# EAGLE design Power_28_10_15_v7 (EAGLE 6.2)
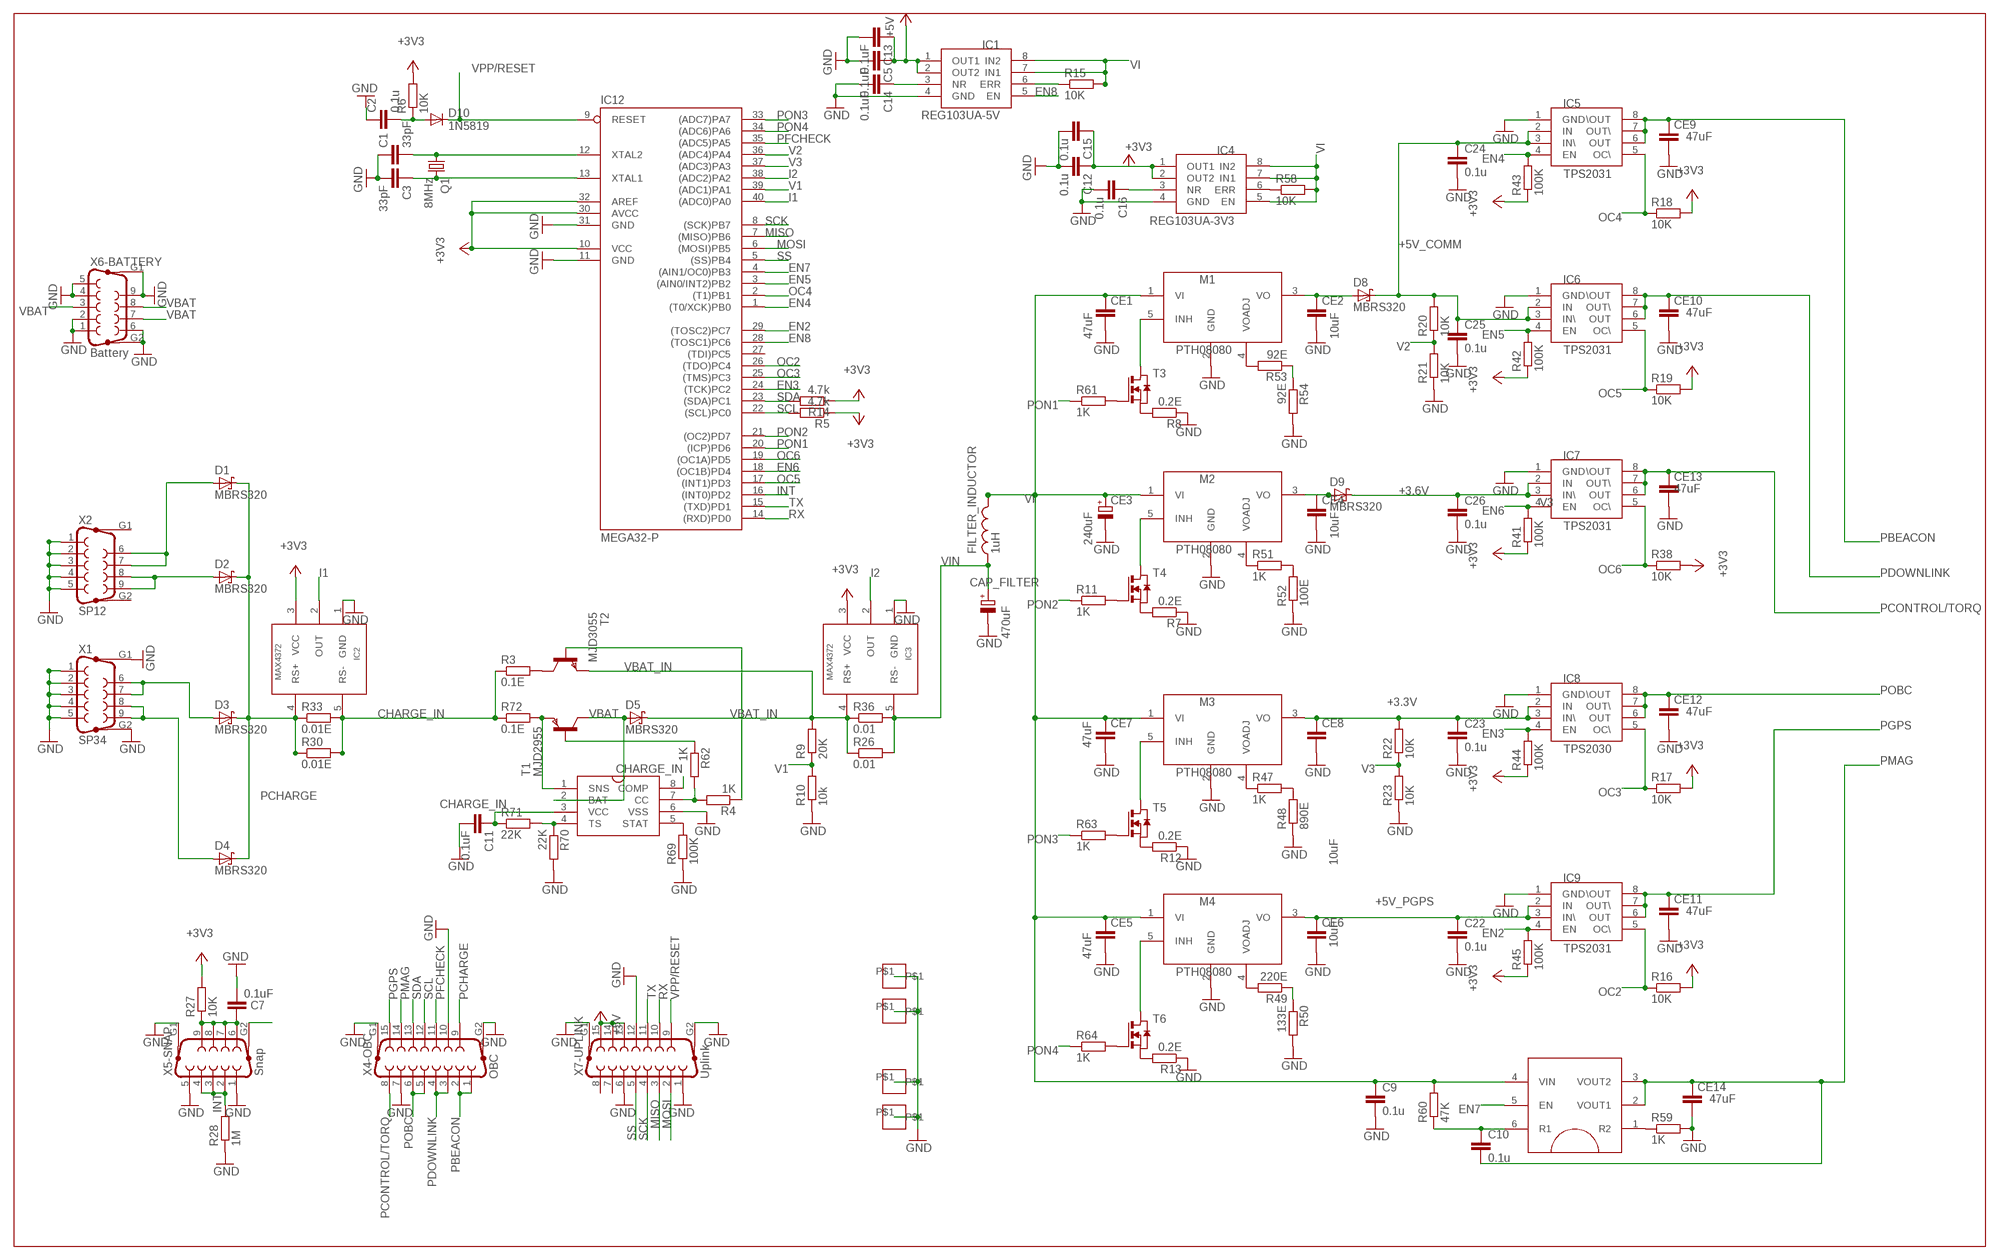
[diagram p0: schematic, sheet 1]

## Parts
C1  33pF  C-EUC1206  [C1206]
C2  0.1u  C-EUC1206  [C1206]
C3  33pF  C-EUC1206  [C1206]
C5  0.1uF  C-EUC1206  [C1206]
C7  0.1uF  C-EUC1206  [C1206]
C9  0.1u  C-EUC1206  [C1206]
C10  0.1u  C-EUC1206  [C1206]
C11  0.1uF  C-EUC1206  [C1206]
C12  0.1u  C-EUC1206  [C1206]
C13  0.1uF  C-EUC1206  [C1206]
C14  0.1uF  C-EUC1206  [C1206]
C15  0.1u  C-EUC1206  [C1206]
C16  0.1u  C-EUC1206  [C1206]
C22  0.1u  C-EUC1206  [C1206]
C23  0.1u  C-EUC1206  [C1206]
C24  0.1u  C-EUC1206  [C1206]
C25  0.1u  C-EUC1206  [C1206]
C26  0.1u  C-EUC1206  [C1206]
CAP_FILTER  470uF  CAP-POLT3  [CAP-POL-T3]
CE1  47uF  C-EUC1206K  [C1206K]
CE2  10uF  C-EUC1206K  [C1206K]
CE3  240uF  CAP-POLT2  [CAP-POL-T2]
CE4  10uF  C-EUC1206K  [C1206K]
CE5  47uF  C-EUC1206K  [C1206K]
CE6  10uF  C-EUC1206K  [C1206K]
CE7  47uF  C-EUC1206K  [C1206K]
CE8  10uF  C-EUC1206K  [C1206K]
CE9  47uF  C-EUC1206K  [C1206K]
CE10  47uF  C-EUC1206K  [C1206K]
CE11  47uF  C-EUC1206K  [C1206K]
CE12  47uF  C-EUC1206K  [C1206K]
CE13  47uF  C-EUC1206K  [C1206K]
CE14  47uF  C-EUC1206K  [C1206K]
D1  MBRS320  [DIODE]
D2  MBRS320  [DIODE]
D3  MBRS320  [DIODE]
D4  MBRS320  [DIODE]
D5  MBRS320  [DIODE]
D8  MBRS320  [DIODE]
D9  MBRS320  [DIODE]
D10  1N5819  DIODE-D-5  [D-5]
FILTER_INDUCTOR  1uH  MSS1260  [MSS1260]
IC1  REG103UA-5V  REG103UA-5  [SO8]
IC2  MAX4372  [SOT-23-5]
IC3  MAX4372  [SOT-23-5]
IC4  REG103UA-3V3  REG103UA-5  [SO8]
IC5  TPS2031  TPS203X  [SO-8]
IC6  TPS2031  TPS203X  [SO-8]
IC7  TPS2031  TPS203X  [SO-8]
IC8  TPS2030  TPS203X  [SO-8]
IC9  TPS2031  TPS203X  [SO-8]
IC10  FDC6324  [SUPER-SOT-6]
IC11  BO2057  [SOIC-8]
IC12  MEGA32-P  [DIL40]
M1  PTH08080  [DIP-05]
M2  PTH08080  [DIP-05]
M3  PTH08080  [DIP-05]
M4  PTH08080  [DIP-05]
Q1  8MHz  CRYSTALHC49S  [HC49/S]
R3  0.1E  R-EU_R1206  [R1206]
R4  1K  R-EU_R1206  [R1206]
R5  4.7k  R-EU_R1206  [R1206]
R6  10K  R-EU_R1206  [R1206]
R7  0.2E  R-EU_R1206  [R1206]
R8  0.2E  R-EU_R1206  [R1206]
R9  20K  R-EU_R1206  [R1206]
R10  10k  R-EU_R1206  [R1206]
R11  1K  R-EU_R1206  [R1206]
R12  0.2E  R-EU_R1206  [R1206]
R13  0.2E  R-EU_R1206  [R1206]
R14  4.7k  R-EU_R1206  [R1206]
R15  10K  R-EU_R1206  [R1206]
R16  10K  R-EU_R1206  [R1206]
R17  10K  R-EU_R1206  [R1206]
R18  10K  R-EU_R1206  [R1206]
R19  10K  R-EU_R1206  [R1206]
R20  10K  R-EU_R1206  [R1206]
R21  10K  R-EU_R1206  [R1206]
R22  10K  R-EU_R1206  [R1206]
R23  10K  R-EU_R1206  [R1206]
R26  0.01  R-EU_R1206  [R1206]
R27  10K  R-EU_R1206  [R1206]
R28  1M  R-EU_R1206  [R1206]
R30  0.01E  R-EU_R1206  [R1206]
R33  0.01E  R-EU_R1206  [R1206]
R36  0.01  R-EU_R1206  [R1206]
R38  10K  R-EU_R1206  [R1206]
R41  100K  R-EU_R1206  [R1206]
R42  100K  R-EU_R1206  [R1206]
R43  100K  R-EU_R1206  [R1206]
R44  100K  R-EU_R1206  [R1206]
R45  100K  R-EU_R1206  [R1206]
R47  1K  R-EU_R1206  [R1206]
R48  890E  R-EU_R1206  [R1206]
R49  220E  R-EU_R1206  [R1206]
R50  133E  R-EU_R1206  [R1206]
R51  1K  R-EU_R1206  [R1206]
R52  100E  R-EU_R1206  [R1206]
R53  92E  R-EU_R1206  [R1206]
R54  92E  R-EU_R1206  [R1206]
R58  10K  R-EU_R1206  [R1206]
R59  1K  R-EU_R1206  [R1206]
R60  47K  R-EU_R1206  [R1206]
R61  1K  R-EU_R1206  [R1206]
R62  1K  R-EU_R1206  [R1206]
R63  1K  R-EU_R1206  [R1206]
R64  1K  R-EU_R1206  [R1206]
R69  100K  R-EU_R1206  [R1206]
R70  22K  R-EU_R1206  [R1206]
R71  22K  R-EU_R1206  [R1206]
R72  0.1E  R-EU_R1206  [R1206]
T1  MJD2955  [DPAK-TO252]
T2  MJD3055  [DPAK-TO252]
T3  NMOSSOT23  [SOT-23]
T4  NMOSSOT23  [SOT-23]
T5  NMOSSOT23  [SOT-23]
T6  NMOSSOT23  [SOT-23]
U$4  MOUNT_SQ  [MOUNT_10MM]
U$16  MOUNT_SQ  [MOUNT_10MM]
U$18  MOUNT_SQ  [MOUNT_10MM]
U$19  MOUNT_SQ  [MOUNT_10MM]
X1  SP34  F09HP  [F09HP]
X2  SP12  F09HP  [F09HP]
X4-OBC  OBC  F15HP  [F15HP]
X5-SNAP  Snap  F09HP  [F09HP]
X6-BATTERY  Battery  F09HP  [F09HP]
X7-UPLINK  Uplink  F15HP  [F15HP]

## Nets
+3.3V [Power]: C23.1 CE8.1 IC8.2(IN) IC8.3(IN\) M3.3(VO) R22.2
+3.6V [Power]: C26.1 D9.C IC7.2(IN) IC7.3(IN\)
+3V3 [Power]: C12.1 C15.1 IC2.3(VCC) IC3.3(VCC) IC4.1(OUT1) IC4.2(OUT2) IC12.10(VCC) IC12.30(AVCC) IC12.32(AREF) R5.1 R6.2 R14.1 R16.2 R17.2 R18.2 R19.2 R27.2 R38.2 R41.1 R42.1 R43.1 R44.1 R45.1
+5V [Power]: C5.1 C13.1 IC1.1(OUT1) IC1.2(OUT2) X7-UPLINK.13 X7-UPLINK.14 X7-UPLINK.15
+5V_COMM [Power]: C24.1 C25.1 D8.C IC5.2(IN) IC5.3(IN\) IC6.2(IN) IC6.3(IN\) R20.2
+5V_PGPS [Power]: C22.1 CE6.1 IC9.2(IN) IC9.3(IN\) M4.3(VO)
CHARGE_IN [Power]: C11.1 IC2.5(RS-) IC11.3(VCC) IC11.8(COMP) R3.1 R30.2 R33.2 R71.1 R72.1
EN2: IC9.4(EN) IC12.29((TOSC2)PC7) R45.2
EN3: IC8.4(EN) IC12.24((TCK)PC2) R44.2
EN4: IC5.4(EN) IC12.1((T0/XCK)PB0) R43.2
EN5: IC6.4(EN) IC12.3((AIN0/INT2)PB2) R42.2
EN6: IC7.4(EN) IC12.18((OC1B)PD4) R41.2
EN7: IC10.5(EN) IC12.4((AIN1/OC0)PB3)
EN8: IC1.5(EN) IC12.28((TOSC1)PC6)
GND [Power]: C1.1 C2.1 C3.2 C5.2 C7.2 C9.2 C11.2 C12.2 C13.2 C14.2 C15.2 C16.2 C22.2 C23.2 C24.2 C25.2 C26.2 CAP_FILTER.P$2(-) CE1.2 CE2.2 CE3.P$2(-) CE4.2 CE5.2 CE6.2 CE7.2 CE8.2 CE9.2 CE10.2 CE11.2 CE12.2 CE13.2 CE14.2 IC1.4(GND) IC2.1(GND) IC3.1(GND) IC4.4(GND) IC5.1(GND) IC6.1(GND) IC7.1(GND) IC8.1(GND) IC9.1(GND) IC11.6(VSS) IC12.11(GND) IC12.31(GND) M1.2(GND) M2.2(GND) M3.2(GND) M4.2(GND) R7.1 R8.1 R10.1 R12.1 R13.1 R21.1 R23.1 R28.1 R48.1 R50.2 R52.1 R54.2 R59.2 R69.1 R70.2 U$4.P$1 U$16.P$1 U$18.P$1 U$19.P$1 X1.1 X1.2 X1.3 X1.4 X1.5 X1.G1 X1.G2 X2.1 X2.2 X2.3 X2.4 X2.5 X4-OBC.7 X4-OBC.10 X4-OBC.G1 X4-OBC.G2 X5-SNAP.1 X5-SNAP.5 X5-SNAP.G1 X5-SNAP.G2 X6-BATTERY.1 X6-BATTERY.2 X6-BATTERY.4 X6-BATTERY.5 X6-BATTERY.6 X6-BATTERY.9 X6-BATTERY.G1 X6-BATTERY.G2 X7-UPLINK.1 X7-UPLINK.6 X7-UPLINK.12 X7-UPLINK.G1 X7-UPLINK.G2
I1: IC2.2(OUT) IC12.40((ADC0)PA0)
I2: IC3.2(OUT) IC12.38((ADC2)PA2)
INT: IC12.16((INT0)PD2) R28.2 X5-SNAP.2 X5-SNAP.3 X5-SNAP.4
MISO: IC12.7((MISO)PB6) X7-UPLINK.3
MOSI: IC12.6((MOSI)PB5) X7-UPLINK.2
N$1: D3.A X1.6 X1.7
N$2: D2.A X2.8 X2.9
N$3: C7.1 R27.1 X5-SNAP.6 X5-SNAP.7 X5-SNAP.8 X5-SNAP.9
N$4: C16.1 IC4.3(NR)
N$5: C14.1 IC1.3(NR)
N$6: C2.2 D10.A R6.1
N$7: IC4.6(ERR) R58.1
N$8: R3.2 T2.2(C)
N$9 [Power]: CE2.1 D8.A M1.3(VO)
N$10 [Power]: CE4.1 D9.A M2.3(VO)
N$11: R4.1 T2.1(B)
N$12: C10.1 IC10.6(R1) R60.1
N$15: IC1.6(ERR) R15.1
N$16: M1.5(INH) T3.1(D)
N$18: M3.5(INH) T5.1(D)
N$19: M4.5(INH) T6.1(D)
N$20: R7.2 T4.2(S)
N$21: C3.1 IC12.13(XTAL1) Q1.2
N$22: R61.2 T3.3(G)
N$23: R8.2 T3.2(S)
N$24: R11.2 T4.3(G)
N$25: D4.A X1.8 X1.9
N$26: IC10.1(R2) R59.1
N$27: C1.2 IC12.12(XTAL2) Q1.1
N$28: R63.2 T5.3(G)
N$29: R12.2 T5.2(S)
N$30: R64.2 T6.3(G)
N$31: R13.2 T6.2(S)
N$32: M2.5(INH) T4.1(D)
N$34: D1.A X2.6 X2.7
N$45: M3.4(VOADJ) R47.1
N$46: R47.2 R48.2
N$47: M4.4(VOADJ) R49.2
N$48: R49.1 R50.1
N$49: M2.4(VOADJ) R51.1
N$50: R51.2 R52.2
N$51: M1.4(VOADJ) R53.2
N$52: R53.1 R54.1
N$57: R62.1 T1.1(B)
N$58: IC11.5(STAT) R69.2
N$59: IC11.4(TS) R70.1 R71.2
N$60: IC11.1(SNS) R72.2 T1.3(E)
N$63: IC11.7(CC) R4.2 R62.2
OC2: IC9.5(OC\) IC12.26((TDO)PC4) R16.1
OC3: IC8.5(OC\) IC12.25((TMS)PC3) R17.1
OC4: IC5.5(OC\) IC12.2((T1)PB1) R18.1
OC5: IC6.5(OC\) IC12.17((INT1)PD3) R19.1
OC6: IC7.5(OC\) IC12.19((OC1A)PD5) R38.1
PBEACON [Power]: CE9.1 IC5.6(OUT) IC5.7(OUT\) IC5.8(\OUT) X4-OBC.1 X4-OBC.2
PCHARGE [Power]: D1.C D2.C D3.C D4.C IC2.4(RS+) R30.1 R33.1 X4-OBC.9
PCONTROL/TORQ [Power]: CE13.1 IC7.6(OUT) IC7.7(OUT\) IC7.8(\OUT) X4-OBC.8
PDOWNLINK [Power]: CE10.1 IC6.6(OUT) IC6.7(OUT\) IC6.8(\OUT) X4-OBC.3 X4-OBC.4
PFCHECK: IC12.35((ADC5)PA5) X4-OBC.11
PGPS [Power]: CE11.1 IC9.6(OUT) IC9.7(OUT\) IC9.8(\OUT) X4-OBC.15
PMAG [Power]: C10.2 CE14.1 IC10.2(VOUT1) IC10.3(VOUT2) X4-OBC.14
POBC [Power]: CE12.1 IC8.6(OUT) IC8.7(OUT\) IC8.8(\OUT) X4-OBC.5 X4-OBC.6
PON1: IC12.20((ICP)PD6) R61.1
PON2: IC12.21((OC2)PD7) R11.1
PON3: IC12.33((ADC7)PA7) R63.1
PON4: IC12.34((ADC6)PA6) R64.1
RX: IC12.14((RXD)PD0) X7-UPLINK.10
SCK: IC12.8((SCK)PB7) X7-UPLINK.4
SCL: IC12.22((SCL)PC0) R5.2 X4-OBC.12
SDA: IC12.23((SDA)PC1) R14.2 X4-OBC.13
SS: IC12.5((SS)PB4) X7-UPLINK.5
TX: IC12.15((TXD)PD1) X7-UPLINK.11
V1: IC12.39((ADC1)PA1) R9.1 R10.2
V2: IC12.36((ADC4)PA4) R20.1 R21.2
V3: IC12.37((ADC3)PA3) R22.1 R23.2
VBAT [Power]: D5.A IC11.2(BAT) T1.2(C) X6-BATTERY.3 X6-BATTERY.7 X6-BATTERY.8
VBAT_IN: D5.C IC3.4(RS+) R9.2 R26.1 R36.1 T2.3(E)
VI [Power]: C9.1 CE1.1 CE3.P$1(+) CE5.1 CE7.1 FILTER_INDUCTOR.P$1 IC1.7(IN1) IC1.8(IN2) IC4.5(EN) IC4.7(IN1) IC4.8(IN2) IC10.4(VIN) M1.1(VI) M2.1(VI) M3.1(VI) M4.1(VI) R15.2 R58.2 R60.2
VIN [Power]: CAP_FILTER.P$1(+) FILTER_INDUCTOR.P$2 IC3.5(RS-) R26.2 R36.2
VPP/RESET: D10.C IC12.9(RESET) X7-UPLINK.9
Unconnected: IC12.27((TDI)PC5) X2.G1 X2.G2 X7-UPLINK.7 X7-UPLINK.8

## Library data of the parts
C1-C3 C5 C7 C9-C16 C22-C26 CE1 CE2 CE4-CE14 = rcl:C-EU: CAPACITOR, European symbol
CAP_FILTER CE3 = satellite:CAP-POL
D1-D5 D8 D9 = satellite:MBRS320
D10 = diode:DIODE-: DIODE
FILTER_INDUCTOR = inductor-coilcraft(2):MSS1260: SMT Power Inductor
IC1 IC4 = satellite:REG103UA-5
IC2 IC3 = satellite:MAX4372
IC5-IC9 = satellite:TPS203X
IC10 = satellite:FDC6324
IC11 = satellite:BO2057
IC12 = atmel:MEGA32-P: MICROCONTROLLER 32 Kbytes FLASH 2 Kbytes SRAM 1 Kbytes EEPROM USART 8-channel 10 bit ADC Source: www.atmel.com .. doc2503.pdf; MPN: ATMEGA32-16PU; OC_FARNELL: 1661729; OC_NEWARK: 51P1794
M1-M4 = satellite:PTH08080
Q1 = crystal:CRYSTAL: CRYSTAL
R3-R23 R26-R28 R30 R33 R36 R38 R41-R45 R47-R54 R58-R64 R69-R72 = rcl:R-EU_: RESISTOR, European symbol
T1 = satellite:MJD2955
T2 = satellite:MJD3055
T3-T6 = zetex:NMOSSOT23: MOS FET
U$4 U$16 U$18 U$19 = satellite:MOUNT_SQ
X1 X2 = con-subd:F09HP: SUB-D; OC_FARNELL: unknown; OC_NEWARK: unknown
X4-OBC X7-UPLINK = satellite:F15HP: SUB-D
X5-SNAP X6-BATTERY = satellite:F09HP: SUB-D

## Net classes
0 Signal: clearance 0.305 mm
1 Power: clearance 0.305 mm to class 0, clearance 0.305 mm
2 Signal1: clearance 0.305 mm to class 0, clearance 0.305 mm to class 1, clearance 0.305 mm

## Board
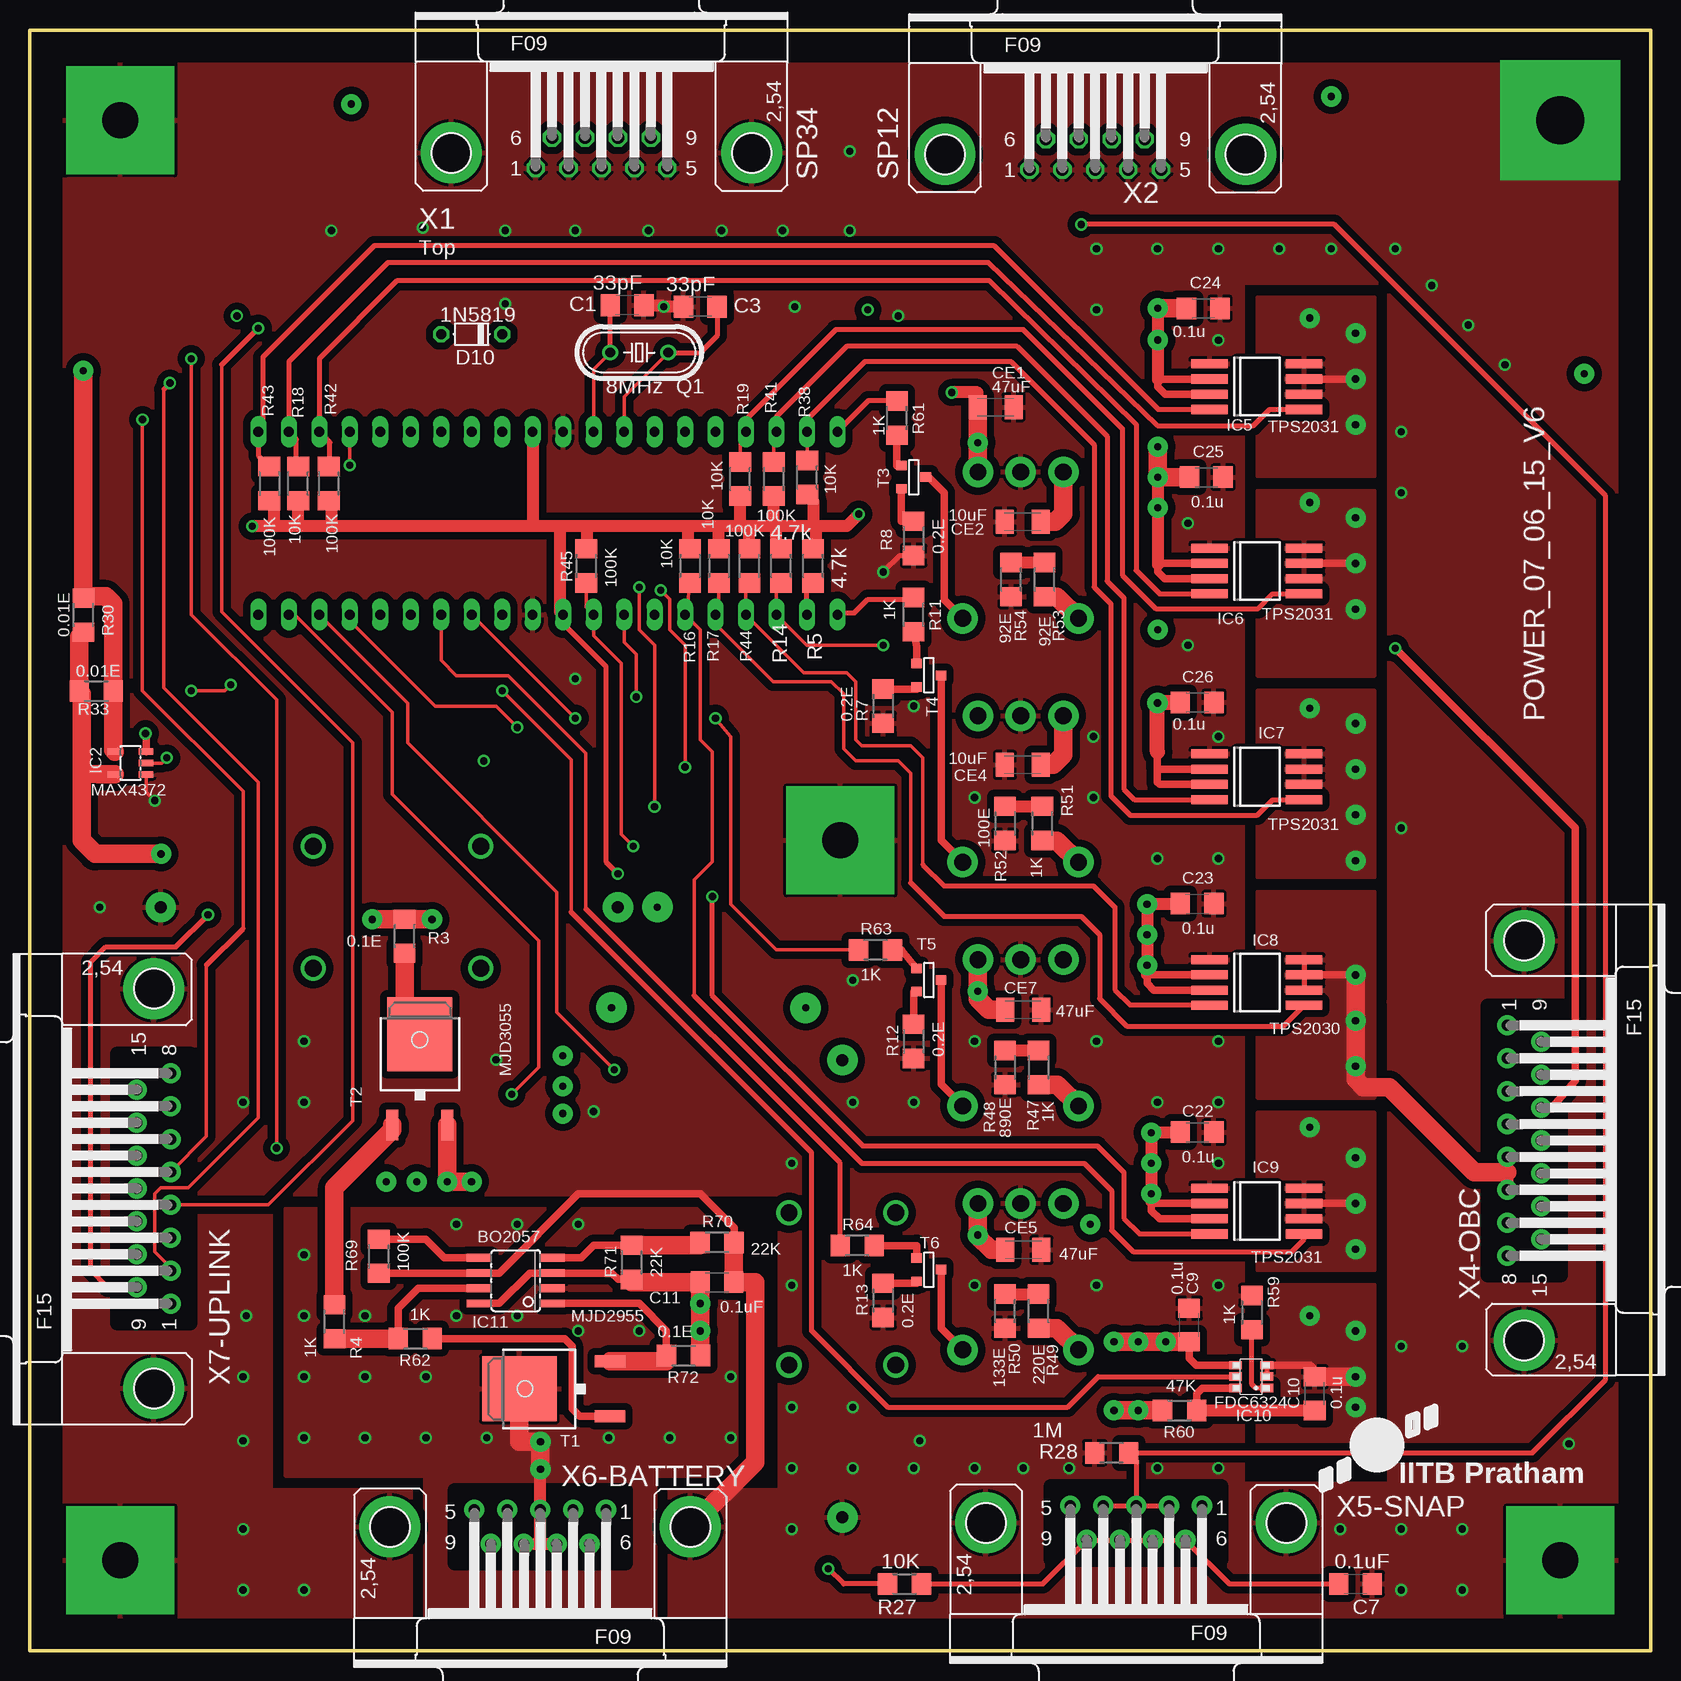
[diagram p1: board, top side]
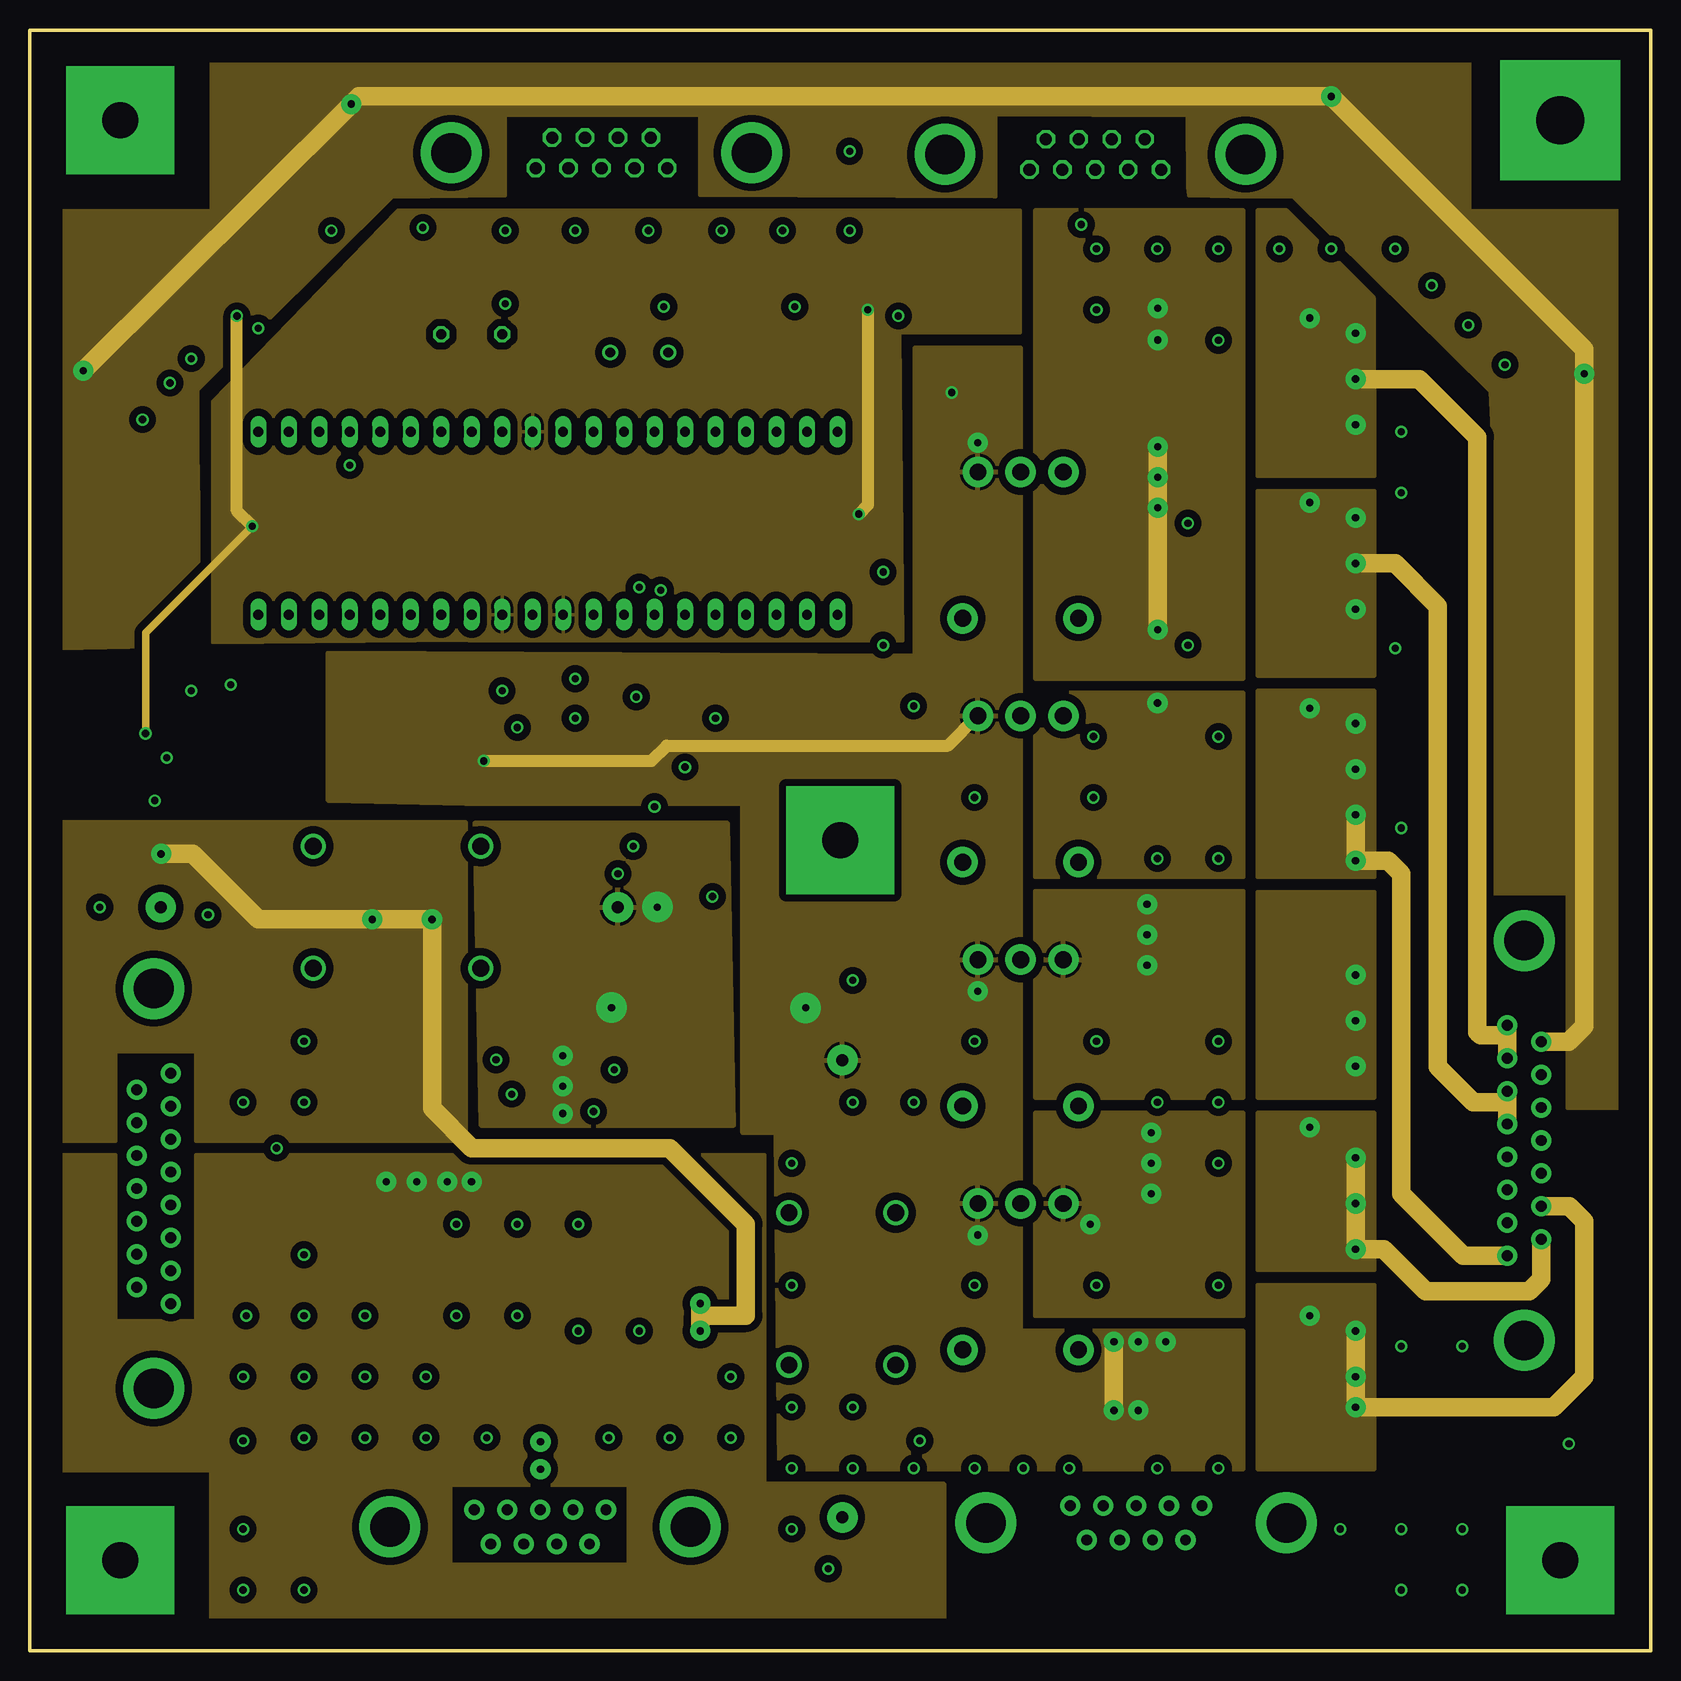
[diagram p2: board, inner layer Power]
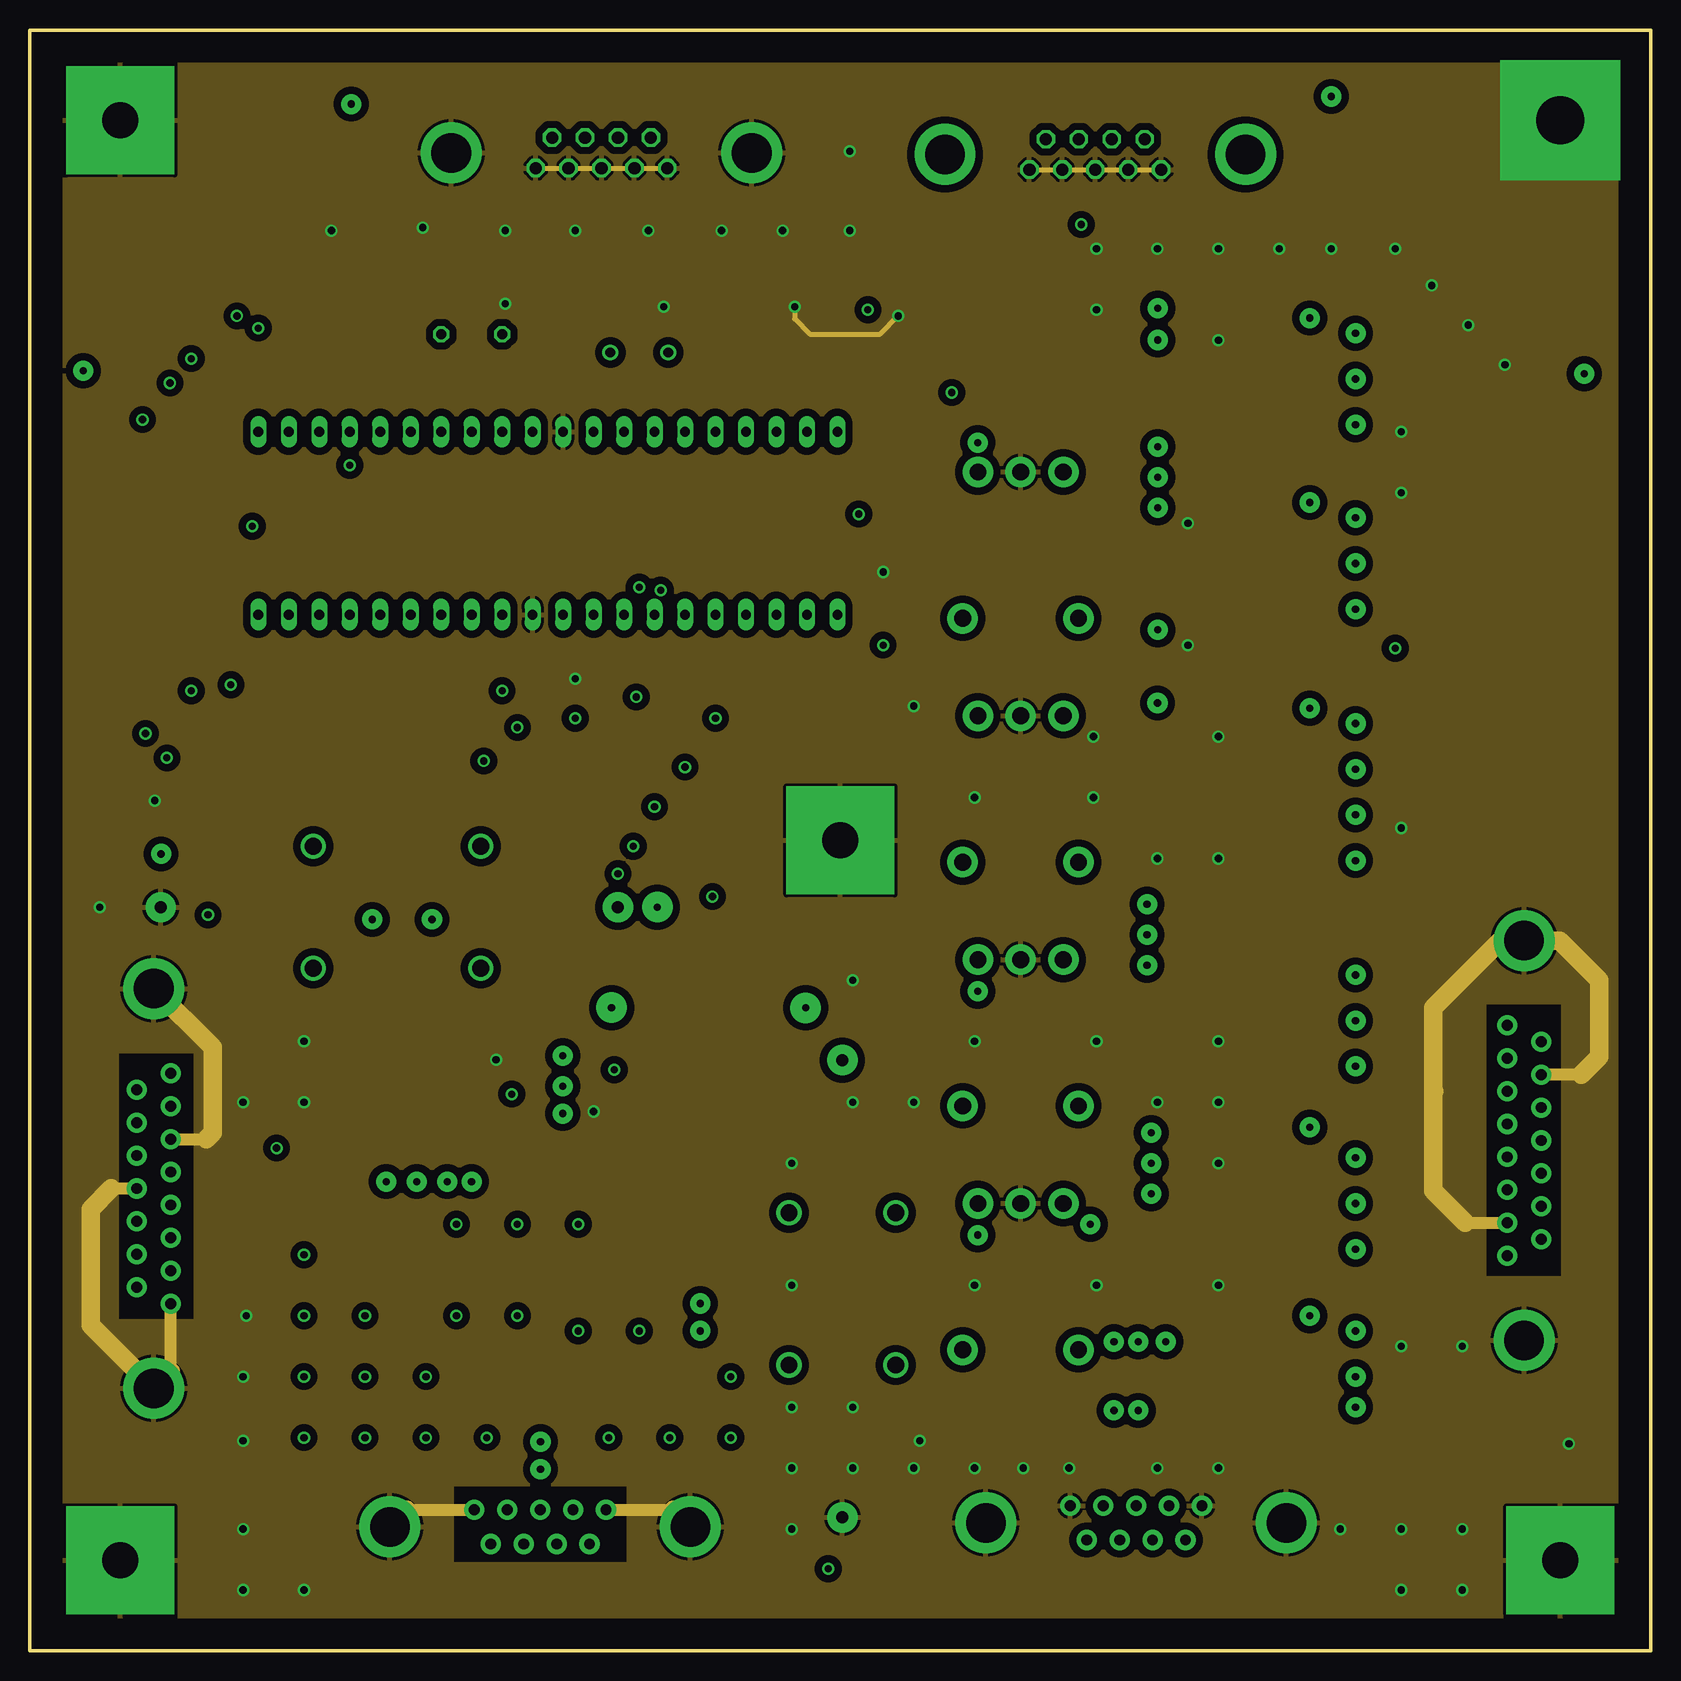
[diagram p3: board, inner layer GND]
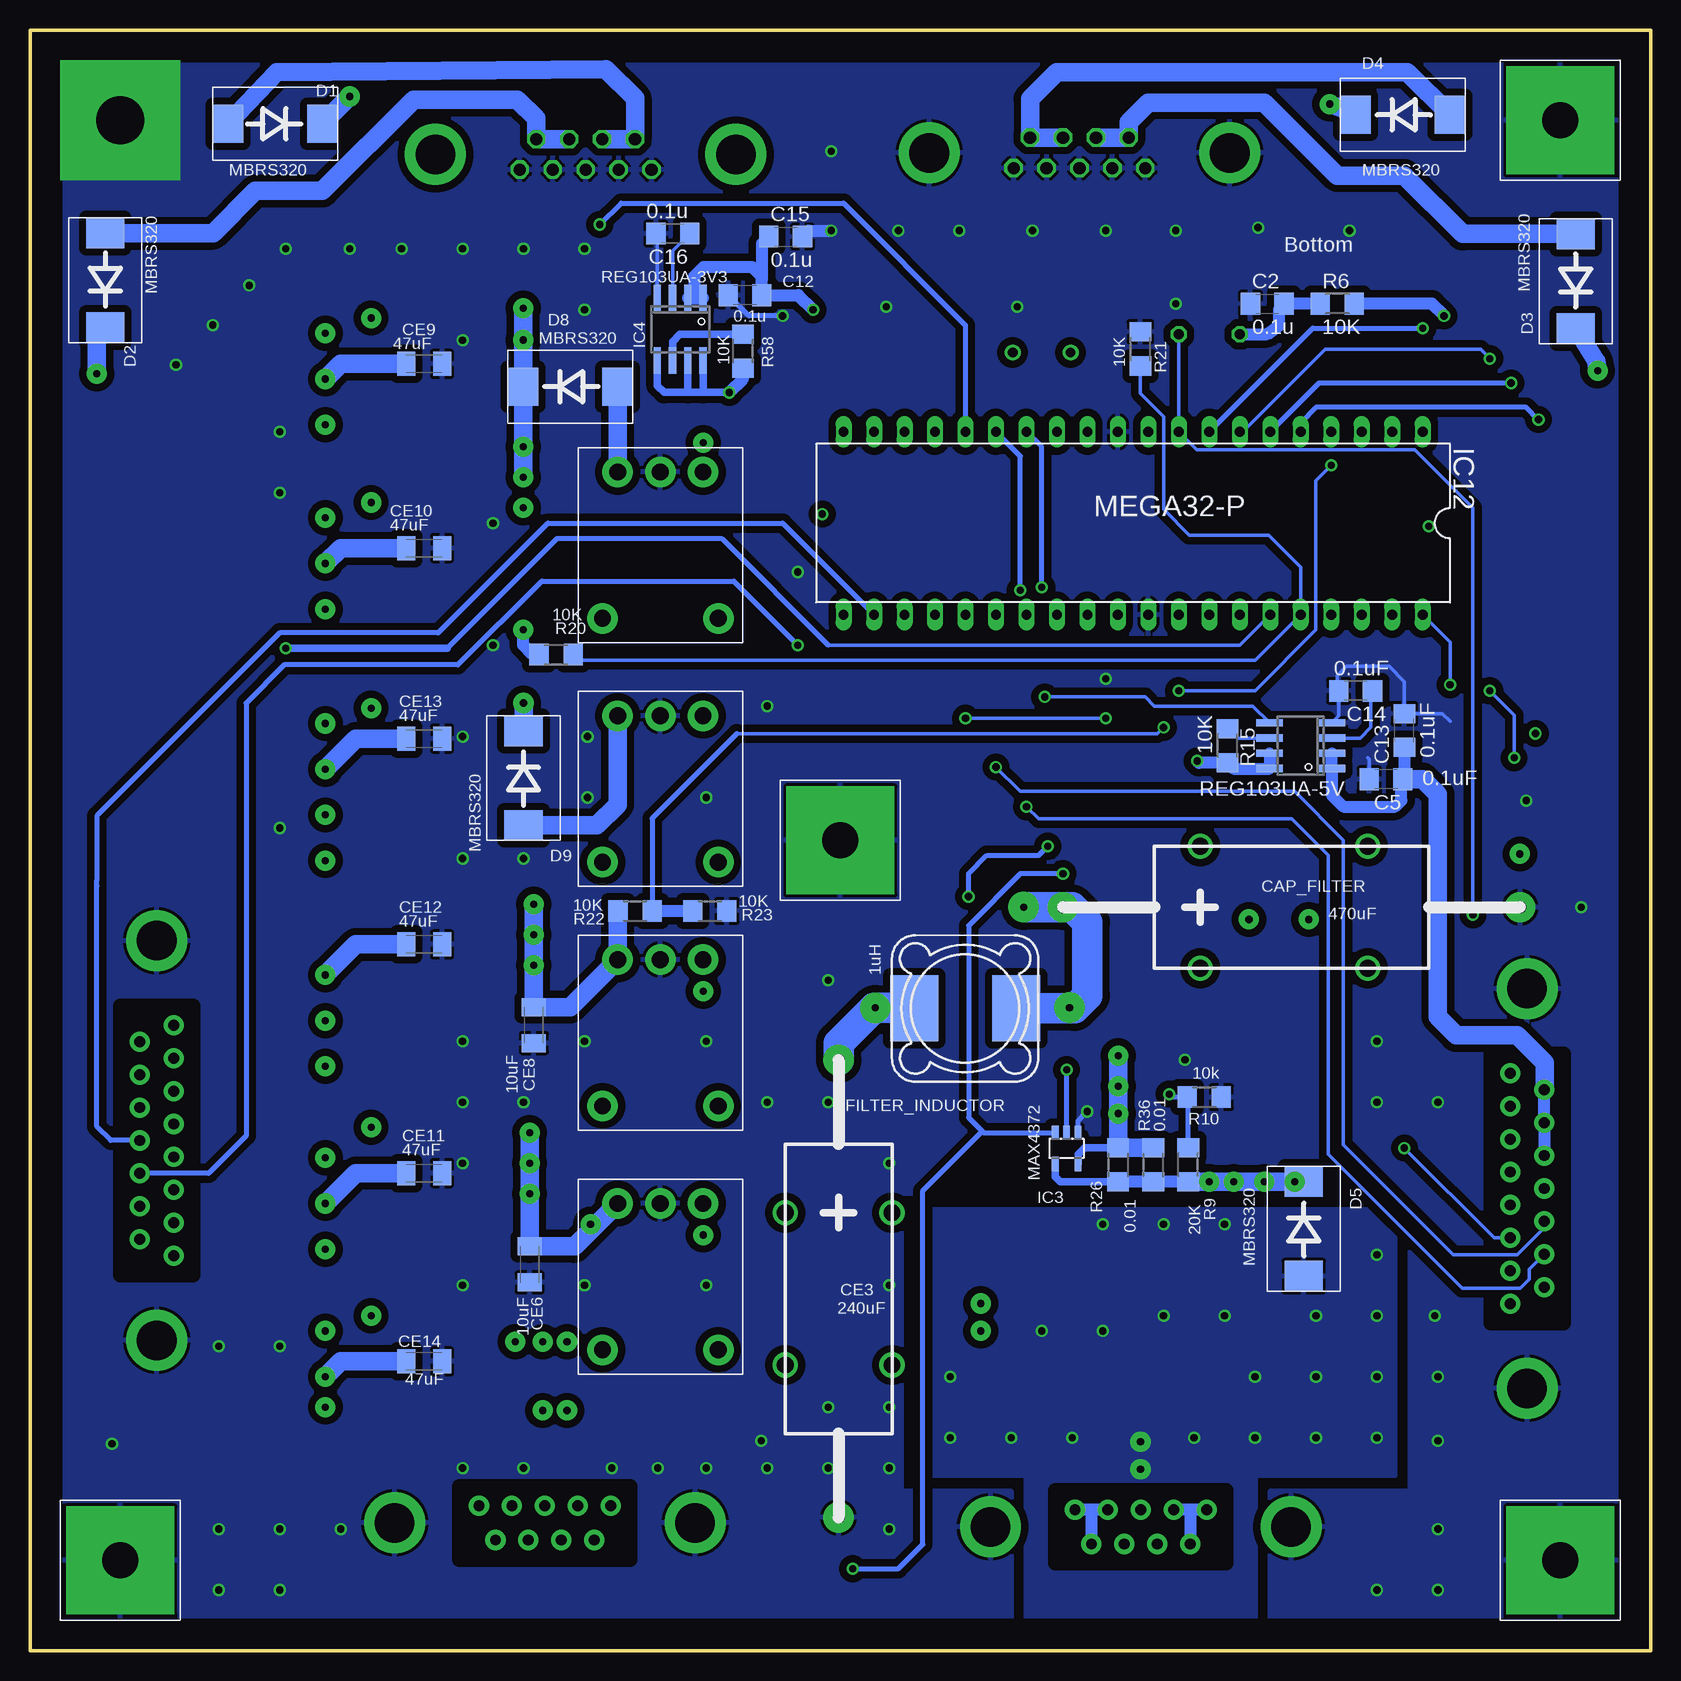
[diagram p4: board, bottom side, seen from below]

Size 135.08 x 135.08 mm. Coordinates in mm from the lower left corner, seen from the top.
Outline: 0,0 135.08,0 135.08,135.08 0,135.08 0,0
Copper layers (1*16): Top 0.07mm / dielectric 1.5mm / Bottom 0.07mm
Design rules: minimum track width 10mil, minimum drill 20mil, track to track 6mil, track to pad 6mil, pad to pad 6mil, via to via 6mil, smd to smd 6mil, copper to edge 100mil, drill to drill 8mil, minimum pad ring 10mil, minimum via ring 8mil, stop-mask expansion 4mil, vias tented up to drill 0mil, thermal gap 10mil

### Footprints (pad centres in the part's own frame; a part is rotated, then mirrored left to right if it is on the bottom)
C1206 = smd 1.6 x 1.8: 1 -1.4,0; 2 1.4,0
CAP-POL-T3 = drill 1 pad 2.54: P$1 -19.05,0; P$2 19.05,0 | drill 1.4 pad 1.397: P$3 -7.62,5.08; P$4 -7.62,-5.08; P$5 6.35,-5.08; P$6 6.35,5.08
C1206K = smd 1.5 x 2: 1 -1.5,0; 2 1.5,0
CAP-POL-T2 = drill 1 pad 2.54: P$1 -19.05,0; P$2 19.05,0 | drill 1.4 pad 1.397: P$3 6.35,4.445; P$4 -6.35,4.445; P$5 -6.35,-4.445; P$6 6.35,-4.445
DIODE = smd 2.54 x 3.175: A 7.366,0; C -0.508,0
D-5 = drill 0.813 octagon: A 2.54,0; C -2.54,0
MSS1260 = smd 5.5 x 4: P$1 0,4.25; P$2 0,-4.25
SO8 = smd 0.6 x 2.2: 1 -1.905,-2.6; 2 -0.635,-2.6; 3 0.635,-2.6; 4 1.905,-2.6; 5 1.905,2.6; 6 0.635,2.6; 7 -0.635,2.6; 8 -1.905,2.6
SOT-23-5 = smd 0.55 x 1.2: 1 -0.95,-1.3; 2 0,-1.3; 3 0.95,-1.3; 4 0.95,1.3; 5 -0.95,1.3
SO-8 = smd 0.762 x 3.048: 1 -1.905,-3.937; 2 -0.635,-3.937; 3 0.635,-3.937; 4 1.905,-3.937; 5 1.905,3.937; 6 0.635,3.937; 7 -0.635,3.937; 8 -1.905,3.937
SUPER-SOT-6 = smd 0.7 x 1.06: 1 -0.95,-1.3; 2 0,-1.3; 3 0.95,-1.3; 4 0.95,1.3; 5 0,1.3; 6 -0.95,1.3
SOIC-8 = smd 0.66 x 2.032: 1 -1.905,-3.073; 2 -0.635,-3.073; 3 0.635,-3.073; 4 1.905,-3.073; 5 1.905,3.073; 6 0.635,3.073; 7 -0.635,3.073; 8 -1.905,3.073
DIL40 = drill 0.813 long: 1 -24.13,-7.62; 2 -21.59,-7.62; 3 -19.05,-7.62; 4 -16.51,-7.62; 5 -13.97,-7.62; 6 -11.43,-7.62; 7 -8.89,-7.62; 8 -6.35,-7.62; 9 -3.81,-7.62; 10 -1.27,-7.62; 11 1.27,-7.62; 12 3.81,-7.62; 13 6.35,-7.62; 14 8.89,-7.62; 15 11.43,-7.62; 16 13.97,-7.62; 17 16.51,-7.62; 18 19.05,-7.62; 19 21.59,-7.62; 20 24.13,-7.62; 21 24.13,7.62; 22 21.59,7.62; 23 19.05,7.62; 24 16.51,7.62; 25 13.97,7.62; 26 11.43,7.62; 27 8.89,7.62; 28 6.35,7.62; 29 3.81,7.62; 30 1.27,7.62; 31 -1.27,7.62; 32 -3.81,7.62; 33 -6.35,7.62; 34 -8.89,7.62; 35 -11.43,7.62; 36 -13.97,7.62; 37 -16.51,7.62; 38 -19.05,7.62; 39 -21.59,7.62; 40 -24.13,7.62
DIP-05 = drill 1.4 pad 2.54: 1 -6.35,3.556; 2 -6.35,0; 3 -6.35,-3.556; 4 5.842,-4.826; 5 5.842,4.826
HC49/S = drill 0.813: 1 -2.413,0; 2 2.413,0
R1206 = smd 1.6 x 1.803: 1 -1.422,0; 2 1.422,0
DPAK-TO252 = smd 1 x 2.54: 1 -2.28,-5.054; 3 2.28,-5.054 | smd 5.4 x 6.2: 2 0,2.5
SOT-23 = smd 0.787 x 0.889: 1 0.025,-1.016; 2 -0.94,1.016; 3 0.991,1.016
MOUNT_10MM = drill 3 pad 9 square: P$1 0,0
F09HP = drill 1.016 octagon: 1 -5.486,-1.27; 2 -2.743,-1.27; 3 0,-1.27; 4 2.743,-1.27; 5 5.486,-1.27; 6 -4.115,1.27; 7 -1.372,1.27; 8 1.372,1.27; 9 4.115,1.27 | drill 3.302 pad 5.08: G1 -12.522,0; G2 12.522,0
F15HP = drill 0.9 pad 1.676: 1 -9.601,-1.422; 2 -6.858,-1.422; 3 -4.115,-1.422; 4 -1.372,-1.422; 5 1.372,-1.422; 6 4.115,-1.422; 7 6.858,-1.422; 8 9.601,-1.422; 9 -8.23,1.422; 10 -5.486,1.422; 11 -2.743,1.422; 12 0,1.422; 13 2.743,1.422; 14 5.486,1.422; 15 8.23,1.422 | drill 3.302 pad 5.08: G1 16.662,0; G2 -16.662,0
F09HP' = drill 0.9 pad 1.676: 1 -5.486,-1.422; 2 -2.743,-1.422; 3 0,-1.422; 4 2.743,-1.422; 5 5.486,-1.422; 6 -4.115,1.422; 7 -1.372,1.422; 8 1.372,1.422; 9 4.115,1.422 | drill 3.302 pad 5.08: G1 -12.522,0; G2 12.522,0

### Placement (x,y rotation side)
C1  49.76,112.14 180 top
C2  31.98,112.27 0 bottom
C3  55.85,112.01 180 top
C5  22.07,72.64 180 bottom
C7  110.46,5.59 0 top
C9  96.6,27.17 90 top
C10  107.06,21.45 90 top
C11  57.25,30.73 0 top
C12  75.49,112.98 180 bottom
C13  20.55,76.71 90 bottom
C14  24.61,80.01 180 bottom
C15  72.11,117.86 0 bottom
C16  81.51,118.11 180 bottom
C22  97.26,43.23 0 top
C23  97.26,62.28 0 top
C24  97.77,111.89 0 top
C25  98.02,97.82 0 top
C26  97.26,79.04 0 top
CAP_FILTER  29.95,61.98 0 bottom
CE1  80.48,103.66 0 top
CE2  82.73,94.1 180 top
CE3  67.69,30.18 270 bottom
CE4  82.73,73.84 180 top
CE5  82.78,33.43 0 top
CE6  93.45,32.21 270 bottom
CE7  82.75,53.42 0 top
CE8  93.09,52.15 270 bottom
CE9  102.23,107.27 0 bottom
CE10  102.23,91.9 0 bottom
CE11  102.23,39.83 0 bottom
CE12  102.23,58.88 0 bottom
CE13  102.23,76.03 0 bottom
CE14  102.23,24.13 0 bottom
D1  111.23,127.25 180 bottom
D2  128.8,110.79 90 bottom
D3  6.27,110.72 90 bottom
D4  24.1,128.02 0 bottom
D5  28.93,38.61 270 bottom
D8  93.47,105.36 0 bottom
D9  93.95,76.17 270 bottom
D10  36.8,109.73 180 top
FILTER_INDUCTOR  57.15,53.55 90 bottom
IC1  29.18,75.44 90 bottom
IC2  8.38,73.99 90 top
IC3  48.69,41.88 180 bottom
IC4  80.9,110.14 180 bottom
IC5  102.23,105.36 270 top
IC6  102.23,90 270 top
IC7  102.23,72.85 270 top
IC8  102.23,55.7 270 top
IC9  102.23,36.66 270 top
IC10  101.77,22.86 90 top
IC11  40.49,30.86 90 top
IC12  43.15,93.98 180 bottom
M1  82.55,91.9 270 bottom
M2  82.55,71.58 270 bottom
M3  82.55,51.26 270 bottom
M4  82.55,30.94 270 bottom
Q1  50.77,108.2 0 top
R3  31.22,59.56 270 top
R4  25.37,27.43 270 top
R5  65.25,90.42 270 top
R6  26.14,112.27 0 bottom
R7  71.09,78.74 90 top
R8  73.63,92.71 90 top
R9  38.56,40.51 270 bottom
R10  37.23,46.15 180 bottom
R11  73.63,86.36 270 top
R12  73.63,50.8 90 top
R13  71.09,29.21 90 top
R14  62.59,90.42 270 top
R15  35.28,75.44 270 bottom
R16  54.99,90.42 90 top
R17  57.4,90.42 90 top
R18  22.35,97.28 270 top
R19  59.18,97.66 270 top
R20  91.24,83.03 180 bottom
R21  42.55,108.51 270 bottom
R22  84.66,61.67 180 bottom
R23  78.44,61.67 180 bottom
R26  44.4,40.51 90 bottom
R27  72.87,5.59 180 top
R28  90.14,16.51 0 top
R30  4.45,86.31 270 top
R33  5.51,79.98 180 top
R36  41.48,40.51 90 bottom
R38  64.77,97.79 270 top
R41  61.98,97.66 90 top
R42  24.89,97.28 90 top
R43  19.94,97.28 90 top
R44  59.94,90.42 270 top
R45  46.36,90.42 270 top
R47  84.05,48.62 90 top
R48  81.25,48.62 90 top
R49  84.05,28.32 270 top
R50  81.25,28.32 270 top
R51  84.35,68.96 90 top
R52  81.25,68.96 90 top
R53  84.56,89.28 270 top
R54  81.76,89.28 270 top
R58  75.65,108.31 270 bottom
R59  101.83,28.19 90 top
R60  95.8,20.05 180 top
R61  72.24,102.74 270 top
R62  32.11,26.04 180 top
R63  70.46,58.42 0 top
R64  68.94,33.78 0 top
R69  29.06,32.89 90 top
R70  57.25,34.04 0 top
R71  50.14,32.38 90 top
R72  54.46,24.61 180 top
T1  43.28,21.84 90 top
T2  32.49,48.89 0 top
T3  73.63,97.79 90 top
T4  74.9,81.28 90 top
T5  74.9,55.88 90 top
T6  74.9,31.75 90 top
U$4  7.54,127.54 180 bottom
U$16  7.54,7.54 180 bottom
U$18  127.54,7.54 180 bottom
U$19  67.54,67.54 180 bottom
X1  47.62,124.84 0 top
X2  88.77,124.71 0 top
X4-OBC  124.51,42.54 270 top
X5-SNAP  Snap  [F09HP']  92.18,10.67 180 top
X6-BATTERY  Battery  [F09HP']  42.51,10.34 180 top
X7-UPLINK  10.31,38.54 90 top

### Tracks (layer width: path | path; a pad name or v marks a point on that pad's centre or on a via)
+3.3V  (via drill 0.6 pad 1.68)
  Top 0.61: 93.09,56.34 IC8.2 | 93.09,56.39 93.09,56.34 | IC8.3 93.65,55.07 93.09,55.63 93.09,56.34
  Top 1.016: C23.1 93.14,62.28 v93.09,62.23 93.09,56.39
  Bottom 1.524: v93.09,62.23 CE8.1 90.07,53.65 M3.3 86.11,61.67 R22.2
  other vias: 93.09,57.15 93.09,59.69
  pour Power (isolate 0.61): 83.79,63.32 101.07,63.32 101.07,46.1 83.79,46.1
+3.6V  (via drill 0.6 pad 1.68)
  Top 0.61: 93.95,73.48 93.95,74.93 | 93.95,73.48 IC7.2 | IC7.3 94.13,72.22 93.95,72.39 93.95,73.48
  Top 1.27: C26.1 93.95,79.05 v93.95,78.99 93.95,74.93
  Bottom 1.524: v93.95,78.99 D9.C
  pour Power (isolate 0.61): 83.79,79.83 101.07,79.83 101.07,64.52 83.79,64.52
+3V3  (via drill 0.6)
  Top 0.305: 9.68,76.4 v9.63,76.45
  Top 0.406: R27.2 67.79,5.59 v66.52,6.86 | IC12.30 44.42,85.6 47.98,82.04 47.98,65.79 v49,64.77
  Top 0.61: IC2.3 9.68,76.4
  Top 1.016: v69.06,94.74 68.05,93.73 65.51,93.73 | 65.51,93.73 65.25,93.73 | 65.25,93.73 62.2,93.73 | 62.2,93.73 61.95,93.73 | 61.95,93.73 59.92,93.73 | 59.92,93.73 59.16,93.73 | 59.16,93.73 57.38,93.73 | 57.38,93.73 54.84,93.73 | 54.84,93.73 46.46,93.73 | 46.46,93.73 44.17,93.73 | 44.17,93.73 41.88,93.73 | 41.88,93.73 25.12,93.73 | 25.12,93.73 22.33,93.73 | 22.33,93.73 20.29,93.73 | 20.29,93.73 v18.52,93.73 | R43.1 20.29,95.5 20.29,93.73 | R18.2 22.33,95.84 22.33,93.73 | R42.1 25.12,95.63 25.12,93.73 | R45.1 46.46,91.95 46.46,93.73 | IC12.10 41.88,93.73 | IC12.30 44.17,86.61 44.17,93.73 | R16.2 54.84,92 54.84,93.73 | R17.2 57.38,91.87 57.38,93.73 | R44.1 59.92,91.87 59.92,93.73 | R14.1 62.2,92.23 62.2,93.73 | R5.1 65.51,92.1 65.51,93.73 | R19.2 59.16,96.22 59.16,93.73 | R41.1 61.95,96.22 61.95,93.73 | R38.2 65.25,95.89 65.25,93.73
  Power 0.61: v9.63,76.45 9.63,84.84 v18.52,93.73
  Power 1.016: v69.82,111.76 69.82,95.5 v69.06,94.74 | v18.52,93.73 17.25,95 v17.25,111.25
  Bottom 0.406: v66.52,6.86 62.71,6.86 60.68,8.89 60.68,38.35 55.73,43.31 | v49,64.77 52.55,64.77 56.87,60.45 56.87,44.45 55.73,43.31 | 55.73,43.31 55.6,43.18 IC3.3
  Bottom 1.016: v69.82,111.76 71.04,112.98 C12.1 74.09,114.3 74.09,114.5 | v17.25,111.25 18.26,112.27 R6.2 | IC4.2 79.73,112.74 | 79.73,112.74 IC4.1 | 74.09,114.5 74.9,115.32 78.97,115.32 79.73,114.55 79.73,112.74 | C15.1 74.09,117.28 74.09,114.5
  pour Power (isolate 0.61): 30.63,120.05 15.21,104.14 15.21,84.01 36.42,84.21 36.55,84.2 72.75,84.2 72.49,109.86 82.52,109.86 82.52,120.05
+5V
  Bottom 1.016: X7-UPLINK.13 X7-UPLINK.14 X7-UPLINK.15 | IC1.2 IC1.1 26.58,71.31 25.63,70.36 21.31,70.36 20.8,70.87 20.8,72.51 C5.1 20.55,72.77 C13.1
  Bottom 1.524: C5.1 19.02,72.64 17.75,71.37 17.75,52.83 16.23,51.31 11.15,51.31 8.86,49.02 8.86,46.8 X7-UPLINK.15
+5V_COMM  (via drill 0.6 pad 1.68)
  Top 0.61: IC5.3 94.61,104.73 D8.C 93.98,105.97 98.27,105.97 IC5.2 | IC6.3 94.56,89.36 93.98,89.94 93.98,90.53 94.08,90.63 IC6.2
  Top 1.016: v93.98,111.89 93.98,105.97 | v93.98,97.82 93.98,90.53
  Top 1.524: C25.1 v93.98,97.82 v93.98,100.36 | v93.98,111.89 C24.1
  Power 1.524: v93.98,85.09 v93.98,100.36
  Bottom 1.016: R20.2 93.17,83.03 93.98,83.85 v93.98,85.09
  Bottom 1.524: v93.98,97.82 D8.C v93.98,111.89
  other vias: 93.98,109.25 93.98,95.28
  pour Power (isolate 0.61): 83.79,120.05 101.07,120.05 101.07,81.03 83.79,81.03
+5V_PGPS  (via drill 0.6 pad 1.68)
  Top 0.61: 93.45,37.46 93.45,37.34 | IC9.2 93.49,37.29 93.45,37.34 | IC9.3 94.13,36.02 93.45,36.7 93.45,37.34
  Top 1.016: C22.1 93.5,43.23 v93.45,43.18 93.45,37.46
  Bottom 1.524: v93.45,43.18 CE6.1 89.69,33.71 M4.3
  other vias: 93.45,38.1 88.37,35.56 93.45,40.64
  pour Power (isolate 0.61): 83.79,44.83 101.07,44.83 101.07,27.91 83.79,27.91
CHARGE_IN  (via drill 0.6 pad 1.68)
  Top 0.61: IC11.8 39.09,28.96 41.63,31.5 IC11.3 48.49,31.5 49.02,30.96 R71.1
  Top 1.524: v33.5,60.96 31.72,60.96 | v28.52,60.96 31.22,60.96 R3.1 | R72.1 55.86,24.61 v55.86,26.67 v55.85,26.67 v55.85,28.96 C11.1 50.14,30.73 R71.1 | v10.92,66.42 5.44,66.42 4.29,67.56 4.29,73.15 | IC2.5 5.67,73.04 4.29,73.15 | 4.29,84.74 R30.2 4.09,84.54 R33.2 4.29,79.79 4.29,73.15
  Power 1.524: v10.92,66.42 13.56,66.42 19.02,60.96 v28.52,60.96 32.99,60.96 | 55.85,27.94 59.66,27.94 59.66,35.56 53.31,41.91 36.8,41.91 33.5,45.21 v33.5,60.96 | v55.85,28.96 55.85,27.94 | v55.85,26.67 55.85,27.94
  pour Power (isolate 0.61): 2.51,42.55 7.12,42.55 7.12,50.04 13.85,50.04 13.85,42.55 36.3,42.55 36.3,69.02 2.51,69.02
EN2  (via drill 0.6)
  Top 0.305: R45.2 46.35,86.97 IC12.29 46.96,84.58 49.25,82.3 49.25,68.07 v50.27,67.06
  Top 0.406: 98.68,34.75 IC9.4 92.48,34.75 91.16,36.07 91.16,39.88 88.94,42.1 69.38,42.1 56.87,54.61 v56.87,62.87
  Bottom 0.406: v56.87,62.87 56.87,64.77 55.35,66.29 51.03,66.29 v50.27,67.06
EN3
  Top 0.305: 74.4,65.53 74.4,74.42 73.38,75.44 69.32,75.44 68.81,75.95 68.81,80.77 68.05,81.53 64.49,81.53 IC12.24 59.66,88.98
  Top 0.406: 74.4,65.53 76.17,63.75 88.62,63.75 90.4,61.98 90.4,55.12 91.67,53.85 98.25,53.85 IC8.4 | 59.66,88.98 R44.2
EN4
  Top 0.406: IC5.4 94,103.46 80.37,117.09 28.68,117.09 19.41,107.82 19.41,101.98 IC12.1 19.02,99.62 R43.2
EN5
  Top 0.406: IC6.4 94.13,88.09 92.18,90.04 92.18,102.23 79.98,114.17 30.58,114.17 24.1,107.7 IC12.3 24.99,100.71 24.99,99.06 24.89,98.96 R42.2
EN6
  Top 0.305: IC12.18 61.98,101.37 R41.2
  Top 0.406: IC7.4 92.03,70.95 91.16,71.82 91.16,87.76 89.76,89.15 89.76,101.22 82.27,108.71 68.05,108.71 62.2,102.87 IC12.18
EN7  (via drill 0.6)
  Top 0.305: 45.08,61.57 45.08,74.27 v39.34,80.01 | v26.64,98.81 IC12.4
  Top 0.406: IC10.5 89,22.86 86.46,20.32 71.48,20.32 65.13,26.67 65.13,41.53 45.08,61.57
  Bottom 0.305: v39.34,80.01 32.99,80.01 27.91,85.09 27.91,97.54 v26.64,98.81
EN8  (via drill 0.6)
  Top 0.305: IC12.28 49.5,84.07 50.52,83.06 v50.52,79.5
  Bottom 0.305: v50.52,79.5 42.14,79.5 41.38,78.74 33.18,78.74 IC1.5
GND  (via drill 0.6, 4 pad 10)
  Top 0.305: IC2.1 9.68,71.57 v10.39,70.87
  Top 0.406: R8.1 72.47,91.29 v71.09,89.92
  Top 0.61: IC7.1 98.33,74.76 98.37,74.8 | R70.2 58.67,35.28 55.85,38.1 45.69,38.1 39.09,31.5 IC11.6 29.06,31.5 R69.1
  Top 1.016: C1.1 52.68,112.14 v52.81,112.01 C3.2
  Top 1.524: X6-BATTERY.G1 60.43,15.73 60.43,30.73 C11.2 58.65,34.04 R70.2
  GND 0.406: v63.73,112.01 63.73,111 65,109.73 70.84,109.73 v72.36,111.25 | X2.1 X2.2 X2.3 X2.4 X2.5 | X1.1 X1.2 X1.3 X1.4 X1.5
  GND 1.016: 119.61,35.68 X4-OBC.7 | 129.28,48.03 X4-OBC.10 | 6.76,38.54 X7-UPLINK.12 | X7-UPLINK.6 14.69,42.66 | X6-BATTERY.1 53.61,11.76 | 31.41,11.76 X6-BATTERY.5 | 11.74,23.3 X7-UPLINK.1
  GND 1.524: 116.94,46.74 116.94,38.35 119.61,35.68 | 116.94,46.74 116.94,53.6 122.54,59.2 X4-OBC.G2 127.46,59.2 130.78,55.88 130.78,49.53 129.28,48.03 | 116.94,46.74 117.02,46.66 | 6.76,38.54 5.05,36.83 5.05,27.14 X7-UPLINK.G2 11.74,23.3 | 14.69,42.66 15.21,43.18 15.21,50.3 X7-UPLINK.G1 | 53.61,11.76 X6-BATTERY.G1 | X6-BATTERY.G2 31.41,11.76
  Bottom 0.305: IC1.4 26.01,77.92 C14.2 26.14,80.13 26.14,81.28 25.37,82.04 21.82,82.04 20.55,80.77 C13.2 17.38,78.11 16.74,77.47 | C5.2 23.47,74.3 23.6,74.42 | IC4.4 82.8,118 C16.2
  Bottom 0.406: IC3.1 47.74,44.18 v46.96,44.96 | 77.19,112.78 77.19,112.98 C12.2 75.16,111.25 v72.36,111.25
  Bottom 1.016: 38.4,11.76 X6-BATTERY.9 | X6-BATTERY.5 38.4,11.76 | 38.4,11.76 X6-BATTERY.4 | 46.63,11.76 X6-BATTERY.6 | X6-BATTERY.2 46.63,11.76 | 46.63,11.76 X6-BATTERY.1 | C15.2 70.2,118.36 v68.3,118.36
  other vias: 17.75,5.08 17.75,10.16 22.83,5.08 17.75,17.53 17.75,22.86 18.01,27.94 17.75,45.72 22.83,45.72 22.83,50.8 25.12,118.36 39.6,112.27 68.3,124.97 88.87,111.76 88.87,116.84 93.95,116.84 99.03,116.84 104.11,116.84 108.43,116.84 113.77,116.84 119.86,110.49 116.81,113.79 122.91,107.19 114.27,101.6 114.27,96.52 114.27,68.58 38.84,49.28 93.95,15.24 99.03,15.24 114.27,10.16 119.35,10.16 119.35,5.08 114.27,5.08 128.24,17.27 109.19,10.16 86.59,15.24 82.78,15.24 78.71,15.24 73.63,15.24 68.55,15.24 63.47,15.24 74.14,17.53 63.47,10.16 63.47,20.32 68.55,20.32 63.47,30.48 73.63,78.74 5.82,61.98 63.47,40.64 73.63,45.72 68.55,45.72 68.55,55.88 78.71,50.8 88.87,50.8 99.03,50.8 99.03,45.72 93.95,45.72 99.03,40.64 99.03,30.48 88.87,30.48 78.71,30.48 114.27,25.4 119.35,25.4 88.62,71.12 88.62,76.2 78.71,71.12 99.03,76.2 99.03,66.04 93.95,66.04 96.49,83.82 96.49,93.98 99.03,109.22 45.44,81.03 62.71,118.36 32.74,118.62 39.6,118.36 45.44,118.36 51.54,118.36 57.63,118.36 127.54,127.54
  pour Bottom (isolate 0.61): 2.51,132.54 2.51,2.54 31.72,2.54 31.72,13.34 20.07,13.34 20.07,38.1 62.46,38.1 62.46,13.34 53.31,13.34 53.31,2.54 132.51,2.54 132.51,132.54
  pour Top (isolate 0.61): 2.51,2.54 31.72,2.54 31.72,13.34 20.07,13.34 20.07,38.1 62.46,38.1 62.46,13.34 53.31,13.34 53.31,2.54 132.51,2.54 132.51,54.03 113.26,54.03 113.26,13.88 101.07,13.88 101.07,114.05 113.26,114.05 113.26,54.17 132.51,54.17 132.51,132.54 2.51,132.54
  pour GND (isolate 0.61): 2.44,132.24 39.61,132.36 39.94,132.37 40.36,132.37 41.02,132.38 42.04,132.4 42.29,132.41 80.05,132.54 80.05,132.62 81.23,132.54 84.71,132.64 95.81,132.61 96.01,132.59 98.48,132.66 102.35,132.61 106.21,132.59 132.51,132.67 132.51,99.95 132.59,99.95 132.59,86.8 132.53,86.17 132.53,85.34 132.51,84.58 132.51,54.04 121.16,54.04 121.16,31.05 127.83,31.05 127.83,53.91 132.51,53.91 132.51,2.54 99.99,2.54 96.48,2.55 84.23,2.55 83.24,2.56 79.74,2.56 80.05,2.54 49.95,2.54 49.95,13.88 35.09,13.88 35.09,7.21 49.76,7.21 49.76,2.54 2.51,2.54 2.51,27.5 13.85,27.5 13.85,49.97 7.18,49.97 7.18,27.62 2.51,27.62 2.51,85.15 2.42,88.96 2.42,90.81 2.48,92.84 2.48,94.04 2.51,95.44
I1  (via drill 0.6)
  Top 0.305: IC2.2 10.98,73.99 v11.4,74.42 | v13.44,80.01 16.23,80.01 v16.74,80.52
  Bottom 0.305: v11.4,74.42 11.4,77.98 v13.44,80.01 | v16.74,80.52 16.74,84.07 IC12.40
I2  (via drill 0.6)
  Top 0.305: IC12.38 31.47,78.99 31.47,75.69 43.92,63.25 43.92,53.21 v48.69,48.44
  Bottom 0.406: IC3.2 v48.69,48.44
INT  (via drill 0.6)
  Top 0.406: X5-SNAP.4 X5-SNAP.3 | X5-SNAP.3 X5-SNAP.2 | X5-SNAP.3 92.18,15.9 R28.2 125.2,16.51 131.29,22.61 131.29,96.27 108.69,118.87 v87.6,118.87
  Bottom 0.406: v87.6,118.87 85.83,120.65 67.28,120.65 57.12,110.49 IC12.16
MISO  (via drill 0.6)
  Top 0.305: v20.55,41.91 20.55,79.25 13.44,86.36 v13.44,107.7
  Bottom 0.305: X7-UPLINK.3 13.06,34.43 v20.55,41.91 | v13.44,107.7 14.2,108.46 27.15,108.46 34.01,101.6 IC12.7
MOSI  (via drill 0.6)
  Top 0.305: 11.15,105.16 11.15,80.26 19.02,72.39 19.02,44.45 13.18,38.61 10.9,38.61 10.39,38.1 10.39,33.27 11.74,31.93
  Top 0.406: v11.66,105.66 11.15,105.16 | 11.74,31.93 X7-UPLINK.2
  Bottom 0.406: IC12.6 27.66,105.66 v11.66,105.66
N$1
  Bottom 1.524: D3.A 15.7,118.09 20.55,122.94 26.14,122.94 32.23,129.03 41.88,129.03 43.51,127.41 X1.6 X1.7
N$2
  Bottom 1.524: D2.A 119.81,118.16 116.31,121.67 110.72,121.67 103.1,129.29 94.46,129.29 92.89,127.71 X2.9 X2.8
N$3
  Top 0.406: R27.1 84.4,5.59 X5-SNAP.9 X5-SNAP.8 X5-SNAP.7 X5-SNAP.6 99.95,5.59 C7.1
N$4
  Bottom 0.305: IC4.3 81.53,116.69 C16.1
N$5
  Bottom 0.305: IC1.3 24.23,76.07 23.34,76.96 23.34,79.88 C14.1
N$6
  Bottom 1.016: R6.1 C2.2 30.96,111.88 30.96,110.49 31.98,109.73 D10.A
N$7
  Bottom 0.61: IC4.6 81.53,109.12 80.92,109.73 R58.1
N$8
  Top 1.016: T2.2 31.22,51.39
  Top 1.524: 31.22,51.39 R3.2
N$9
  Top 1.524: CE2.1 85.44,94.1 86.11,94.77 M1.3
  Bottom 1.524: M1.3 D8.A
N$10
  Top 1.524: CE4.1 85.27,73.84 86.11,74.68 M2.3
  Bottom 1.524: D9.A 87.83,68.81 86.11,70.54 M2.3
N$11
  Top 1.524: R4.1 25.37,38.61 30.21,43.44 T2.1
N$12
  Top 0.61: IC10.6 97.7,21.91 97.22,21.43 R60.1
  Top 1.016: R60.1 C10.1
N$15
  Bottom 0.305: R15.1 34.49,76.07 IC1.6
N$16
  Top 0.61: T3.1 74.88,97.82 76.17,96.52 76.17,87.61 M1.5
N$18
  Top 0.61: T5.1 75.92,47.22 M3.5
N$19
  Top 0.61: T6.1 75.92,26.9 M4.5
N$20
  Top 0.61: T4.2 73.89,80.16 R7.2
N$21
  Top 0.305: Q1.2 49.5,104.52 IC12.13
  Top 0.406: C3.1 57.25,109.6 55.85,108.2 Q1.2
N$22
  Top 0.61: R61.2 72.24,98.78 T3.3
N$23
  Top 0.61: T3.2 72.62,94.13 R8.2
N$24
  Top 0.61: T4.3 73.89,83.67 R11.2
N$25
  Bottom 1.524: D4.A 20.29,131.57 49.5,131.57 51.74,129.34 X1.9 X1.8
N$26
  Top 0.406: IC10.1 102.14,21.91 101.83,22.22 R59.1
N$27
  Top 0.305: Q1.1 46.96,106.81 IC12.12
  Top 0.406: Q1.1 C1.2
N$28
  Top 0.61: R63.2 72.64,58.39 T5.3
N$29
  Top 0.61: R12.2 73.63,54.94 T5.2
N$30
  Top 0.61: T6.3 73.89,33.78 R64.2
N$31
  Top 0.61: T6.2 73.89,30.63 R13.2
N$32
  Top 0.61: T4.1 75.92,67.54 M2.5
N$34
  Bottom 1.524: D1.A 114.53,131.57 87.1,131.83 84.66,129.39 X2.6 X2.7
N$45
  Top 1.524: R47.1 85.6,47.2 M3.4
N$46
  Top 1.016: R48.2 R47.2
N$47
  Top 1.524: R49.2 85.57,26.9 M4.4
N$48
  Top 1.016: R50.1 R49.1
N$49
  Top 1.524: R51.1 85.58,67.54 M2.4
N$50
  Top 1.016: R52.2 R51.2
N$51
  Top 1.524: R53.2 85.57,87.86 M1.4
N$52
  Top 1.016: R54.1 R53.1
N$57
  Top 0.61: R62.1 44.55,26.04 45.19,25.4 45.19,20.19 45.82,19.56 T1.1
N$58
  Top 0.61: IC11.5 34.52,32.77 32.97,34.31 R69.2
N$59
  Top 0.61: IC11.4 45.95,32.77 46.99,33.81 R71.2
  Top 1.524: R71.2 55.83,33.81 R70.1
N$60
  Top 0.61: IC11.1 50.77,28.96 53.04,26.7 R72.2
  Top 1.524: T1.3 53.04,24.12 R72.2
N$63
  Top 0.61: IC11.7 32.36,30.23 30.68,28.55 R62.2
  Top 1.524: R4.2 25.4,26.04 R62.2
OC2
  Top 0.305: 55.35,54.61 55.35,64.26 56.87,65.79 56.87,74.93 55.85,75.95 55.85,85.09 IC12.26 54.74,86.51 R16.1
  Top 0.406: 55.35,54.61 69.32,40.64 87.86,40.64 90.14,38.35 90.14,35.05 91.92,33.27 105.13,33.27 106.17,34.31 IC9.5
OC3
  Top 0.305: R17.1 57.4,86.64 IC12.25 57.12,85.6 61.95,80.77 66.78,80.77 67.79,79.76 67.79,75.18 68.81,74.17 72.36,74.17 73.38,73.15 73.38,64.01
  Top 0.406: 73.38,64.01 76.17,61.21 87.6,61.21 89.13,59.69 89.13,54.36 91.41,52.07 104.44,52.07 IC8.5
OC4
  Top 0.406: IC5.5 103.3,103.46 101.96,102.11 93.95,102.11 79.86,115.7 29.82,115.7 21.56,107.44 IC12.2 | R18.1 22.3,98.7 22.2,98.81 22.2,100.97 IC12.2 | 21.69,101.73 IC12.2
OC5
  Top 0.305: IC12.17 59.18,101.12 R19.1
  Top 0.406: IC6.5 103.56,88.09 102.34,86.87 93.83,86.87 91.03,89.66 91.03,101.85 82.78,110.11 67.16,110.11 59.66,102.62 IC12.17
OC6
  Top 0.305: IC12.19 64.77,101.58 R38.1
  Top 0.406: 106.16,70.93 103.54,70.93 102.27,69.66 91.67,69.66 90.08,71.25 90.08,87.25 88.68,88.65 88.68,100.52 81.76,107.44 69.57,107.44 64.74,102.62 IC12.19
  Top 0.61: 106.16,70.93 IC7.5
PBEACON  (via drill 0.6 pad 1.68)
  Top 0.61: v110.46,105.99 IC5.7
  Power 1.524: v110.46,105.99 115.77,105.99 120.62,101.14 120.62,51.56 120.88,51.31 123.09,51.31 | 123.09,51.31 X4-OBC.1 | X4-OBC.2 123.09,51.31
  Bottom 1.524: CE9.1 109.19,107.27 v110.46,105.99
  other vias: 110.46,109.8 106.65,111.07 110.46,102.18
  pour Power (isolate 0.61): 102.34,120.05 104.65,120.05 111.93,112.78 111.99,97.92 102.34,97.92
  pour Top (isolate 0.61): 102.34,112.78 111.99,112.78 111.99,97.92 102.34,97.92
PCHARGE  (via drill 0.6 pad 1.68)
  Top 1.524: IC2.4 6.94,75.09 R33.1 6.94,87.27 6.32,87.88 4.59,87.88 R30.1 v4.44,106.68
  Power 1.524: X4-OBC.9 128.21,50.77 129.51,52.07 v129.51,106.43 129.51,108.46 v108.43,129.54 27.41,129.54 v26.77,128.91 v4.44,106.68
  Bottom 1.524: D3.C 4.55,107.47 v4.44,106.68 | D4.C 25.63,128.52 v26.77,128.91 | D2.C 129.51,109.58 v129.51,106.43 | D1.C v108.43,129.54
  pour Power (isolate 0.61): 132.51,45.21 132.51,120.01 119.99,120.02 119.99,132.54 15.09,132.54 15.09,120.02 2.51,120.02 2.51,83.5 14.1,83.76 14.1,84.71 14.06,88.27 14.06,95.63 13.98,99.95 13.98,105.06 30.17,121.13 39.62,121.25 39.62,127.98 55.83,127.98 55.83,121.32 80.32,121.19 80.49,121.19 80.49,128.02 96.44,127.91 96.49,121.92 96.57,121.25 96.7,121.25 100,121.19 105.24,121.19 121.69,104.93 121.94,99.95 122.07,94.61 122.07,88.14 121.94,85.09 121.94,63.12 128.12,63.12 128.12,45.21
PCONTROL/TORQ  (via drill 0.6 pad 1.68)
  Power 1.524: X4-OBC.8 119.44,32.94 114.27,38.1 114.27,64.77 113.18,65.86 v110.46,65.86 v110.46,69.67
  Bottom 1.524: CE13.1 107.92,76.03 v110.46,73.48
  other vias: 110.46,77.29 106.65,78.56
  pour Power (isolate 0.61): 102.34,80.01 111.99,80.01 111.99,64.52 102.34,64.52
  pour Top (isolate 0.61): 102.34,80.01 111.99,80.01 111.99,64.52 102.34,64.52
PDOWNLINK  (via drill 0.6 pad 1.68)
  Top 0.61: v110.46,90.63 IC6.7
  Power 1.524: v110.46,90.63 113.77,90.63 117.32,87.07 117.32,48.67 120.27,45.72 123.09,45.72 | 123.09,45.72 X4-OBC.3 | X4-OBC.4 123.09,45.72
  Bottom 1.524: CE10.1 109.19,91.9 v110.46,90.63
  other vias: 110.46,94.44 110.46,86.82 106.65,95.71
  pour Power (isolate 0.61): 102.34,96.65 111.99,96.65 111.99,81.28 102.34,81.28
  pour Top (isolate 0.61): 102.34,96.65 111.99,96.65 111.99,81.28 102.34,81.28
PFCHECK  (via drill 0.6)
  Top 0.61: X4-OBC.11 126.79,45.28 128.75,47.5 128.75,68.58 v113.77,83.57
  Bottom 0.305: 68.55,83.82 34.26,83.82 IC12.35
  Bottom 0.406: 100.3,83.57 91.16,92.71 77.44,92.71 68.55,83.82
  Bottom 0.61: 100.3,83.57 v113.77,83.57
PGPS  (via drill 0.6 pad 1.68)
  Top 0.61: IC9.7 v110.46,37.29
  Power 1.524: v110.46,41.1 v110.46,37.29 v110.46,33.48 112.8,33.48 116.31,29.97 124.94,29.97 125.94,30.97 X4-OBC.15
  Bottom 1.524: CE11.1 107.92,39.83 v110.46,37.29
  other vias: 106.65,43.64
  pour Power (isolate 0.61): 102.34,44.83 111.99,44.83 111.99,31.75 102.34,31.75
  pour Top (isolate 0.61): 102.34,44.83 111.99,44.83 111.99,31.75 102.34,31.75
PMAG  (via drill 0.6 pad 1.68)
  Top 0.406: IC10.3 IC10.2
  Top 0.61: IC10.3 106.67,23.81 107.06,23.42 C10.2
  Top 1.016: 110.45,22.85 v110.46,22.86
  Top 1.524: C10.2 110.45,22.85
  Power 1.524: v110.46,26.67 v110.46,22.86 v110.46,20.32 126.97,20.32 129.51,22.86 129.51,35.81 128.27,37.05 X4-OBC.14
  Bottom 1.524: CE14.1 109.19,24.13 v110.46,22.86
  other vias: 106.65,27.94
  pour Power (isolate 0.61): 102.34,30.48 111.99,30.48 111.99,15.14 102.34,15.14
  pour Top (isolate 0.61): 102.34,30.48 111.99,30.48 111.99,15.14 102.34,15.14
POBC  (via drill 0.6 pad 1.68)
  Top 0.406: IC8.6 IC8.7 IC8.8
  Top 0.61: IC8.7 v110.46,56.34
  Top 1.016: X4-OBC.6 123.09,39.88 X4-OBC.5
  Top 1.524: v110.46,56.34 110.46,47.62 111.1,46.99 113.26,46.99 120.37,39.88 123.09,39.88
  Bottom 1.524: CE12.1 107.92,58.88 v110.46,56.34
  other vias: 110.46,52.53 110.46,48.72
  pour Power (isolate 0.61): 102.34,63.25 111.99,63.25 111.99,46.1 102.34,46.1
  pour Top (isolate 0.61): 102.34,63.25 111.99,63.25 111.99,46.1 102.34,46.1
PON1
  Top 0.406: R61.1 69.85,104.17 IC12.20
PON2
  Top 0.406: IC12.21 67.44,86.51 68.71,86.51 69.82,87.63 73.48,87.63 R11.1
PON3  (via drill 0.6)
  Top 0.305: R63.1 62.2,58.42 58.39,62.23 58.39,76.2 v57.12,77.72 | v45.44,77.72 IC12.33
  Bottom 0.305: v45.44,77.72 v57.12,77.72
PON4
  Top 0.305: 46.33,61.85 46.33,74.8 39.85,81.28 35.53,81.28 34.26,82.55 IC12.34
  Top 0.406: 46.33,61.85 67.51,40.66 R64.1
RX  (via drill 0.6)
  Top 0.305: v52.04,70.36 52.04,83.82 50.77,85.09 v50.77,88.65
  Bottom 0.305: v52.04,70.36 51.03,69.34 29.95,69.34 26.9,66.29 26.9,41.4 15.72,30.23 10.9,30.23 10.13,30.99 10.13,31.81 X7-UPLINK.10
  Bottom 0.406: v50.77,88.65 50.77,100.33 IC12.14
SCK  (via drill 0.6)
  Top 0.305: 15.98,107.19 15.98,86.61 26.9,75.69 26.9,44.2 19.87,37.17 X7-UPLINK.4
  Top 0.406: v19.02,110.24 15.98,107.19
  Bottom 0.406: IC12.8 28.17,110.24 v19.02,110.24
SCL
  Top 0.406: IC12.22 64.74,88.49 R5.2
  Bottom 0.406: IC12.22 72.36,93.98 91.92,93.98 101.07,84.84 114.27,84.84 129.51,69.6 129.51,64.26 129.51,63.75 129.51,43.69 128.37,42.54 X4-OBC.12
SDA  (via drill 0.6)
  Top 0.305: 62.2,88.62 IC12.23 64.74,83.82 v71.09,83.82
  Top 0.406: 62.2,88.62 R14.2
  Bottom 0.406: v71.09,83.82 76.43,89.15 92.43,89.15 99.42,82.17 113.89,82.17 117.07,78.99 117.07,42.93 120.2,39.8 X4-OBC.13
SS  (via drill 0.6)
  Top 0.305: X7-UPLINK.5 14.71,42.88 14.71,57.15 | 17.75,60.2 17.75,71.63 9.37,80.01 v9.37,102.62
  Top 0.406: 14.71,57.15 17.75,60.2
  Bottom 0.406: v9.37,102.62 10.39,103.63 27.91,103.63 29.18,102.36 IC12.5
TX  (via drill 0.6)
  Top 0.305: v54.58,73.66 54.58,83.82 53.31,85.09 53.31,87.63 v52.55,88.39
  Bottom 0.305: v54.58,73.66 52.55,71.63 29.69,71.63 25.63,67.56 25.63,42.16 16.48,33.02 11.15,33.02 9.12,35.05 9.12,35.57 X7-UPLINK.11
  Bottom 0.406: v52.55,88.39 52.55,99.57 IC12.15
V1  (via drill 0.6)
  Top 0.305: IC12.39 22.07,86.36 30.2,78.23 30.2,71.37 42.39,59.18 42.39,48.64 v40.15,46.4
  Bottom 0.406: R9.1 38.56,46.15 R10.2 39.9,46.15 v40.15,46.4
V2
  Bottom 0.305: 90.14,82.55 32.99,82.55 IC12.36 29.18,90.3 31.85,92.96 38.46,92.96 40.61,95.12 40.61,102.87 42.54,104.8 R21.2
  Bottom 0.406: 90.14,82.55 89.82,82.88 R20.1
V3  (via drill 0.6)
  Top 0.305: IC12.37 26.64,85.85 33.76,78.74 38.84,78.74 v40.61,76.96
  Bottom 0.305: 76.17,76.45 41.12,76.45 v40.61,76.96
  Bottom 0.406: R22.1 83.24,69.39 76.17,76.45
  Bottom 1.016: R22.1 R23.2
VBAT  (via drill 0.6, 0.6 pad 1.68)
  Top 1.016: v42.54,15.14 42.54,11.76 42.54,8.92 | 42.54,8.92 X6-BATTERY.7 | X6-BATTERY.8 42.54,8.92
  Top 1.524: 42.54,11.76 X6-BATTERY.3 | v42.54,15.14 v42.54,17.43 40.78,17.43 T1.2
  other vias: 50.77,26.67 45.69,26.67 40.61,27.94 35.53,27.94 22.83,27.94 27.91,27.94 22.83,22.86 22.83,17.78 22.83,33.02 27.91,17.78 32.99,17.78 32.99,22.86 27.91,22.86 38.07,17.78 48.23,17.78 53.31,17.78 58.39,22.86 58.39,17.78 35.53,35.56 40.61,35.56 45.69,35.56
  pour Bottom (isolate 0.61): 21.34,14.61 32.99,14.61 32.99,2.54 52.04,2.54 52.04,14.61 61.19,14.61 61.19,36.83 21.34,36.83
  pour Top (isolate 0.61): 21.34,36.83 61.19,36.83 61.19,14.61 52.04,14.61 52.04,2.54 32.99,2.54 32.99,14.61 21.34,14.61
VBAT_IN  (via drill 0.6 pad 1.68)
  Top 1.524: v36.8,39.11 v34.77,39.11 T2.3
  Bottom 0.61: IC3.4 49.64,39.51 49.23,39.09 R26.1
  Bottom 1.016: R26.1 R36.1 R9.2
  Bottom 1.524: D5.C v32.23,39.12 v32.23,39.11 v34.77,39.11 38.56,39.11 R9.2
  other vias: 29.69,39.11
  pour Power (isolate 0.61): 2.51,41.27 2.51,15.11 15.09,15.11 15.09,2.54 49.76,2.54 49.76,7.14 35.03,7.14 35.03,13.88 49.89,13.88 49.89,2.54 76.17,2.54 76.17,13.88 61.19,13.88 61.19,41.27 13.85,41.27 13.85,27.43 7.12,27.43 7.12,41.27
VI  (via drill 0.6, 0.6 pad 1.02, 0.6 pad 1.68, 0.6 pad 2.54)
  Top 0.61: IC10.4 97.19,23.81 96.6,24.41 C9.1
  Top 1.016: CE1.1 78.98,104.88 v76.81,104.88
  Top 1.524: M4.1 78.99,34.52 80.08,33.43 CE5.1 | M3.1 78.99,54.33 79.91,53.42 CE7.1 | R60.2 v92.36,20.05 v90.33,20.05 | C9.1 v94.64,25.77 v92.36,25.77 v90.33,25.77 | 78.98,98.27 v78.98,100.7 CE1.1
  Power 1.016: v37.82,74.17 51.79,74.17 53.06,75.44 76.5,75.44 M2.1
  Power 1.524: v90.33,20.05 v90.33,25.77
  Bottom 0.406: IC4.8 78.97,107.52 | 80.24,104.88 80.26,104.88
  Bottom 0.61: v76.81,104.88 78.99,104.88 | 78.99,104.88 80.24,104.88 82.25,104.88 82.8,105.43 IC4.5 | 80.26,104.88 IC4.7 | 78.99,104.88 IC4.8
  Bottom 1.016: v76.81,104.88 75.65,106.03 R58.2 | v37.82,74.17 37.67,74.02 R15.2 34.8,73.53 IC1.8 IC1.7
  Bottom 2.54: CE3.P$1 67.69,50.65 64.74,53.59 v64.64,53.59 61.4,53.59 FILTER_INDUCTOR.P$1
  other vias: 78.98,34.66 78.98,54.98
  pour Power (isolate 0.61): 101.07,15.14 62.46,15.14 62.2,43.18 59.41,43.18 59.41,70.61 36.3,70.61 24.87,70.87 24.87,83.19 73.76,82.93 73.76,108.59 82.52,108.59 82.52,26.67 101.07,26.67
VIN  (via drill 0.6 pad 1.68, 0.6 pad 2.54)
  Bottom 0.61: IC3.5 47.74,41.38 47.19,41.94 R26.2
  Bottom 1.524: R36.2 R26.2 v44.4,49.61
  Bottom 2.54: FILTER_INDUCTOR.P$2 48.03,53.55 46.96,54.61 46.96,60.71 48.24,61.98 v52.27,61.98
  other vias: 44.4,44.78 44.4,47.07 48.46,53.6
  pour Power (isolate 0.61): 58.65,43.81 58.14,68.96 37.06,68.96 37.57,43.81
VPP/RESET  (via drill 0.6)
  Top 0.406: v14.83,61.34 12.17,58.67 6.32,58.67 5.05,57.4 5.05,31.75 6.49,30.31 X7-UPLINK.9
  Bottom 0.305: v14.83,61.34 14.83,95.25 19.68,100.1 37.85,100.1 IC12.9 D10.C

### Text on the board
tPlace: Top | IITB Pratham
bPlace: Bottom
tNames: POWER_07_06_15_V6